# EAGLE board Open-Source_Control_Unitary_V2 (EAGLE 9.3.0), part 1 of 2
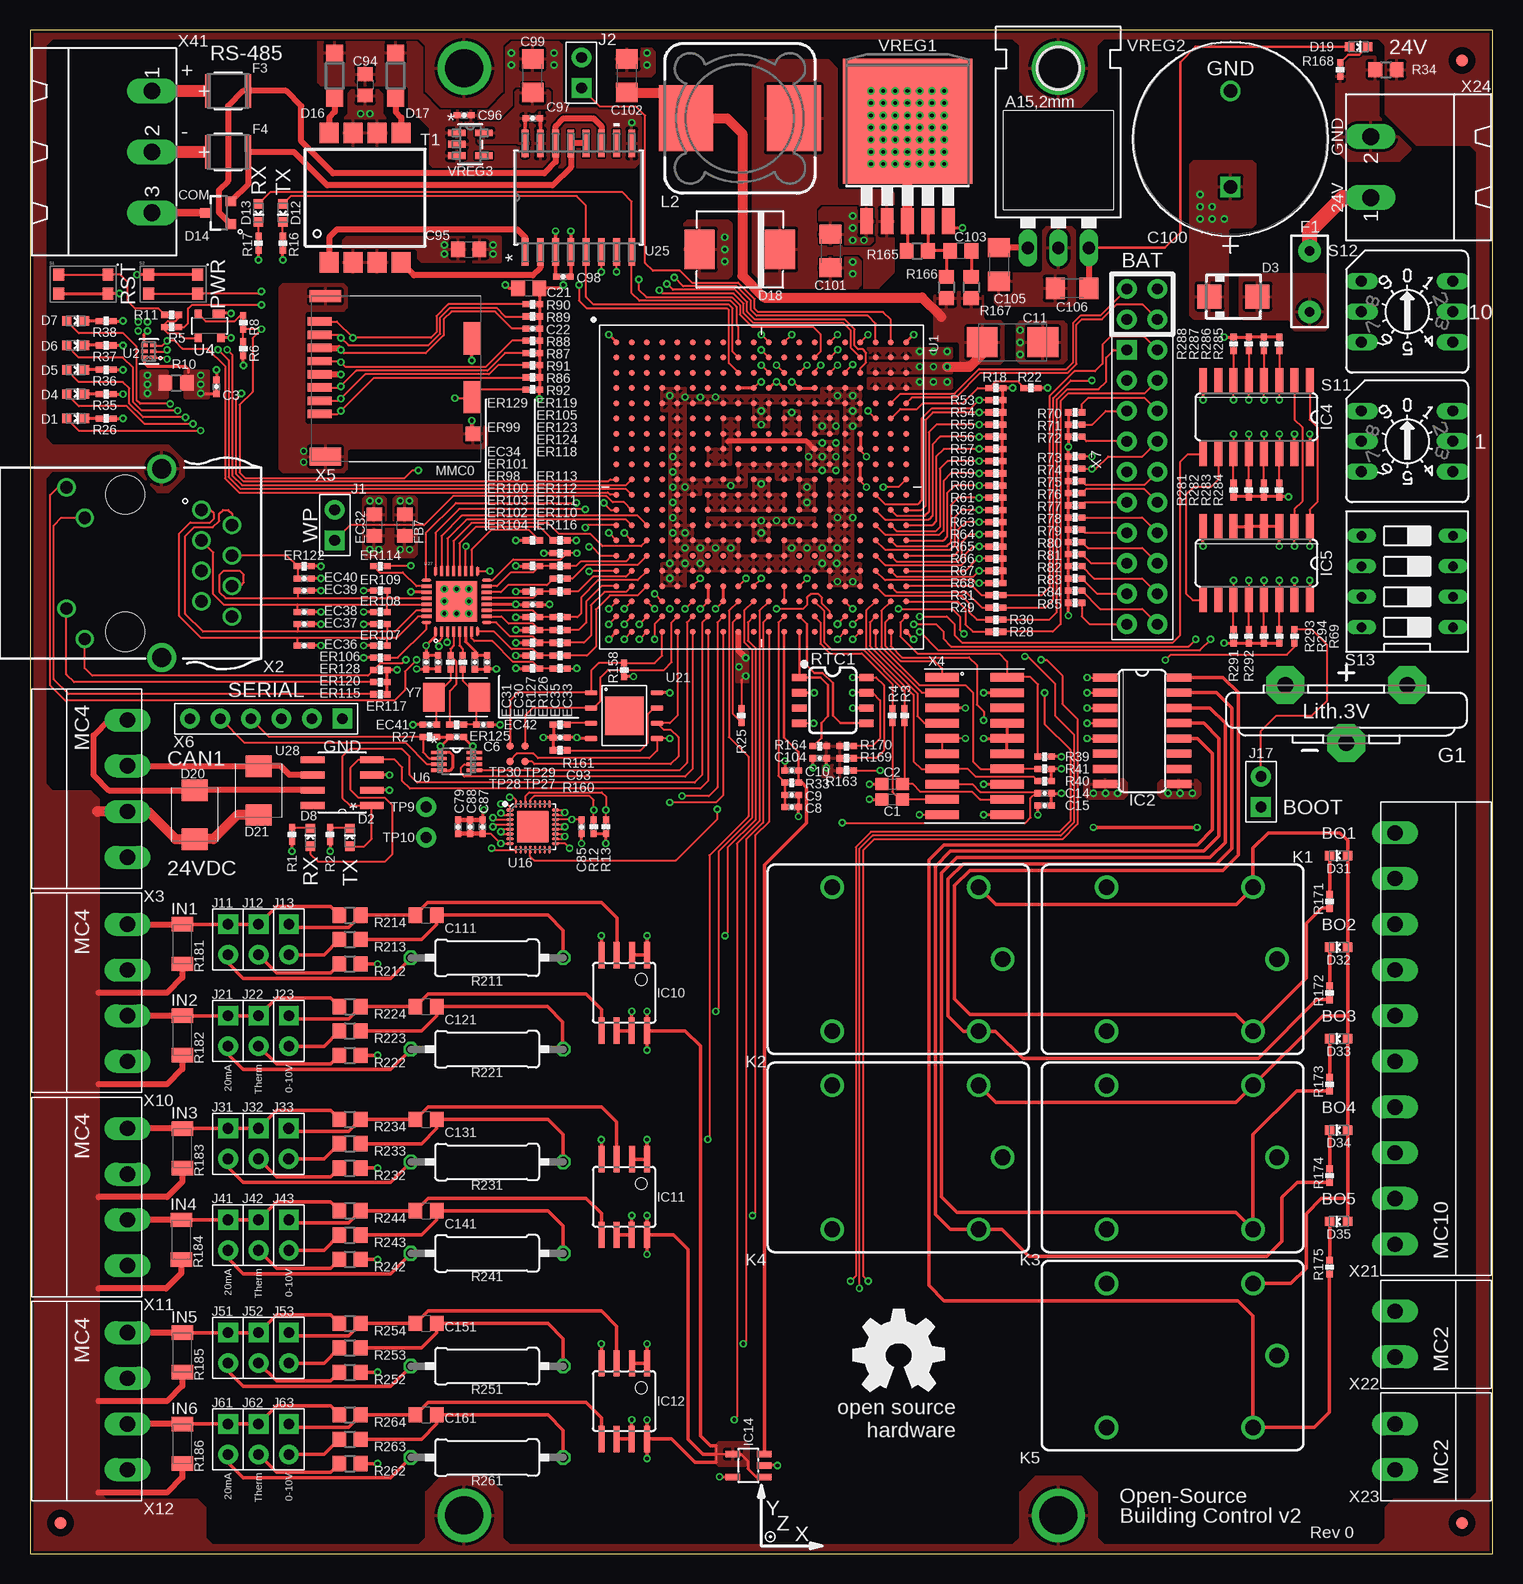
[diagram p7: board, top side]
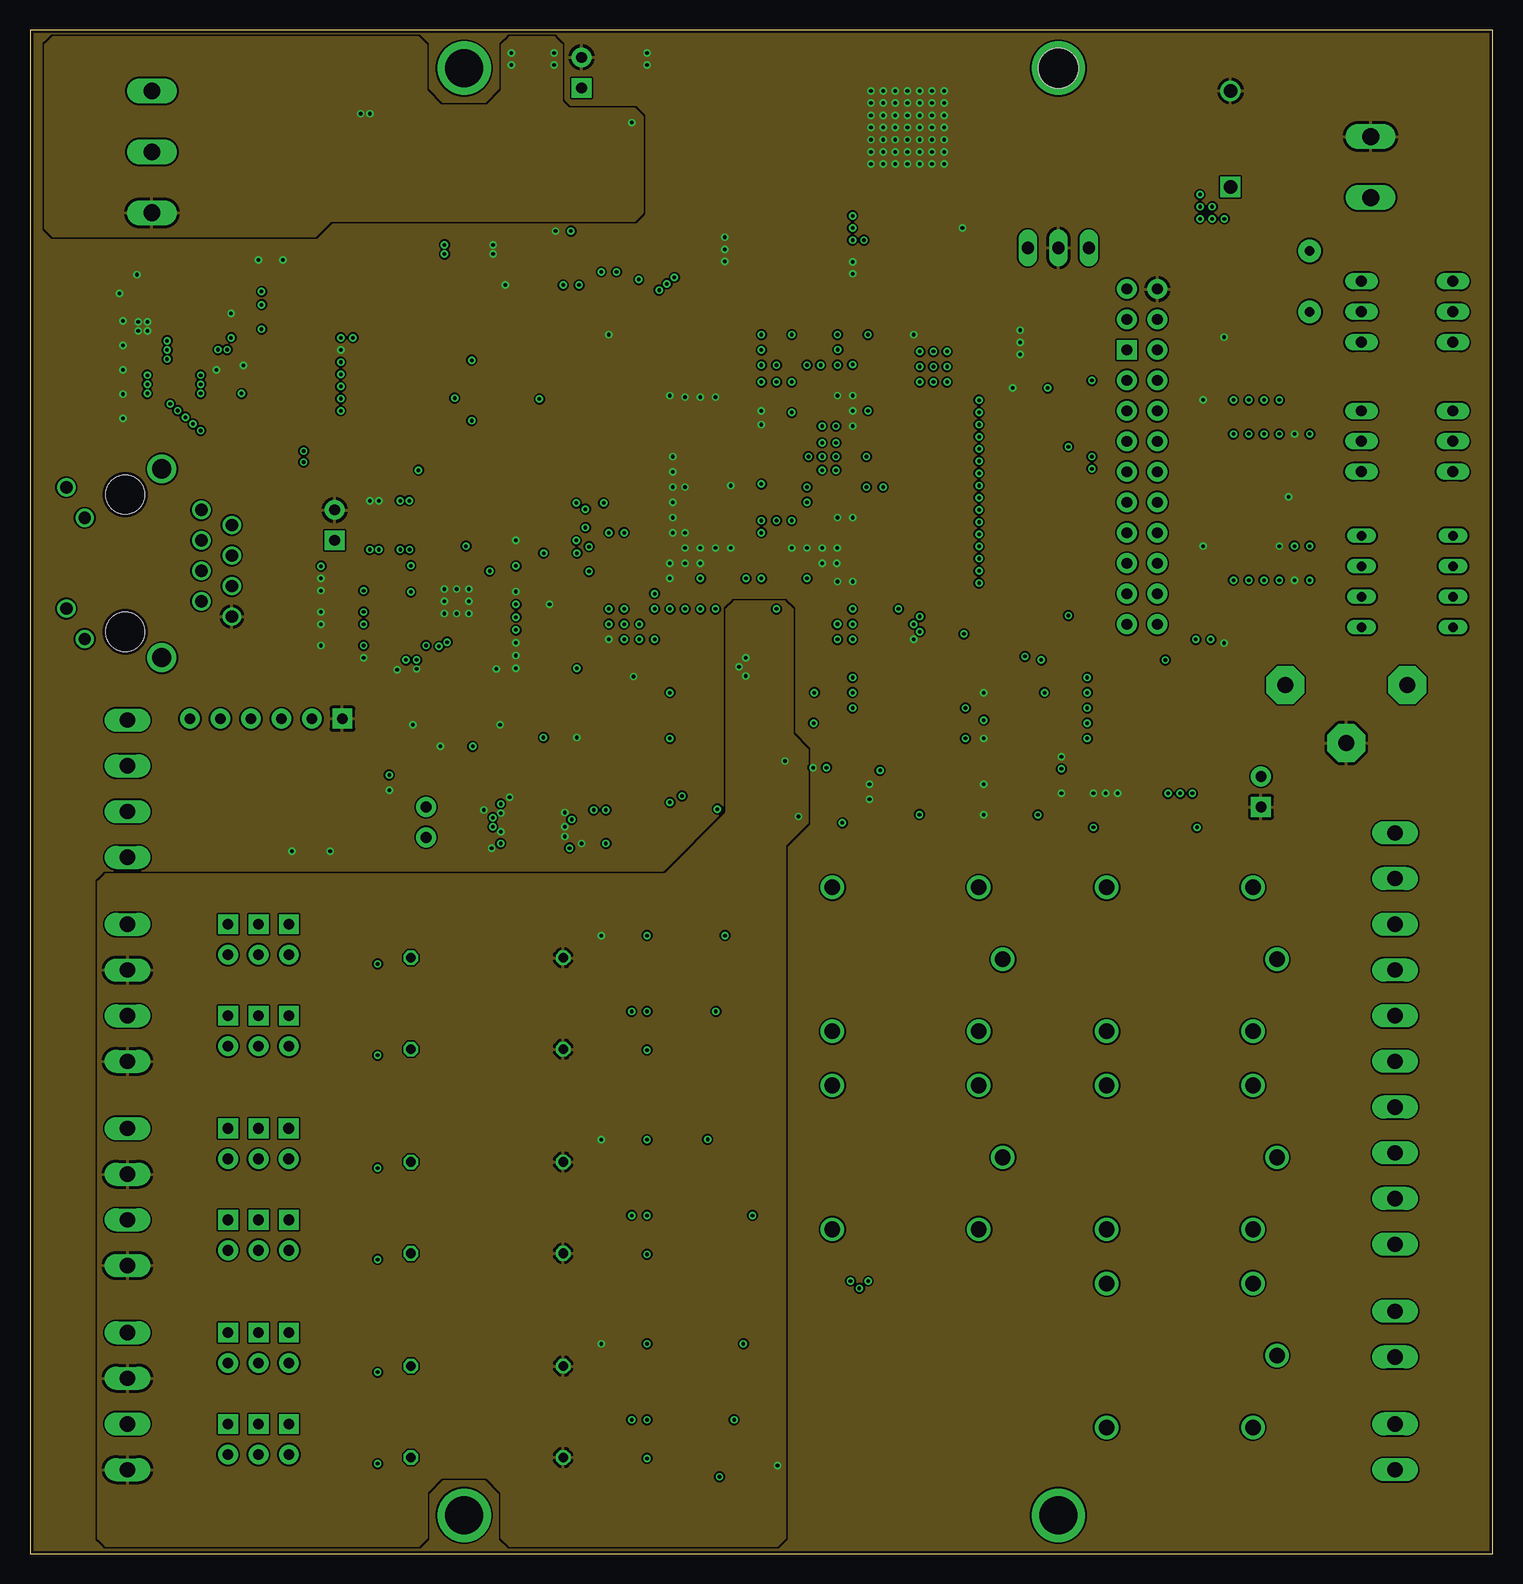
[diagram p8: board, inner layer Route2]
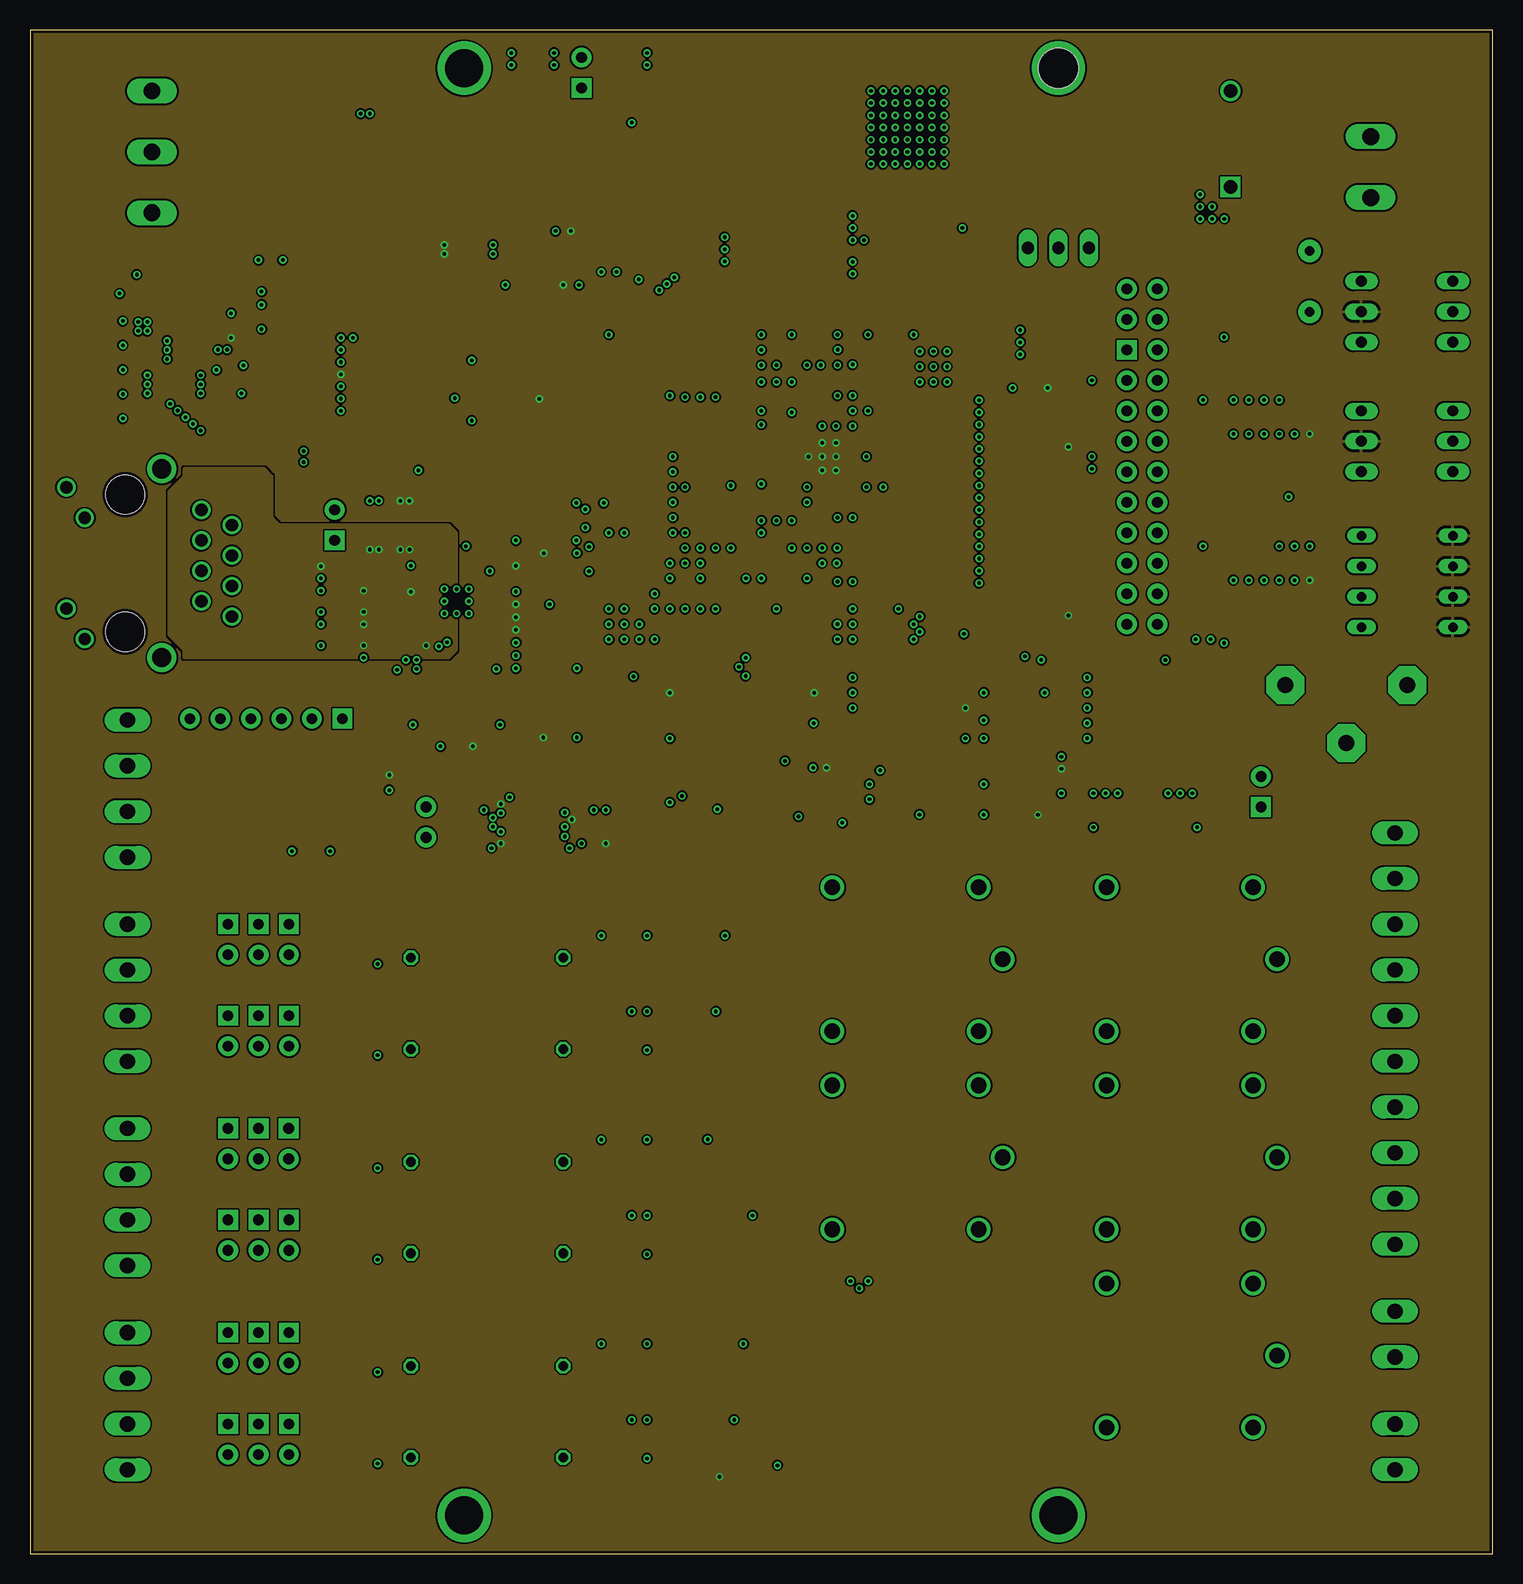
[diagram p9: board, inner layer Route15]
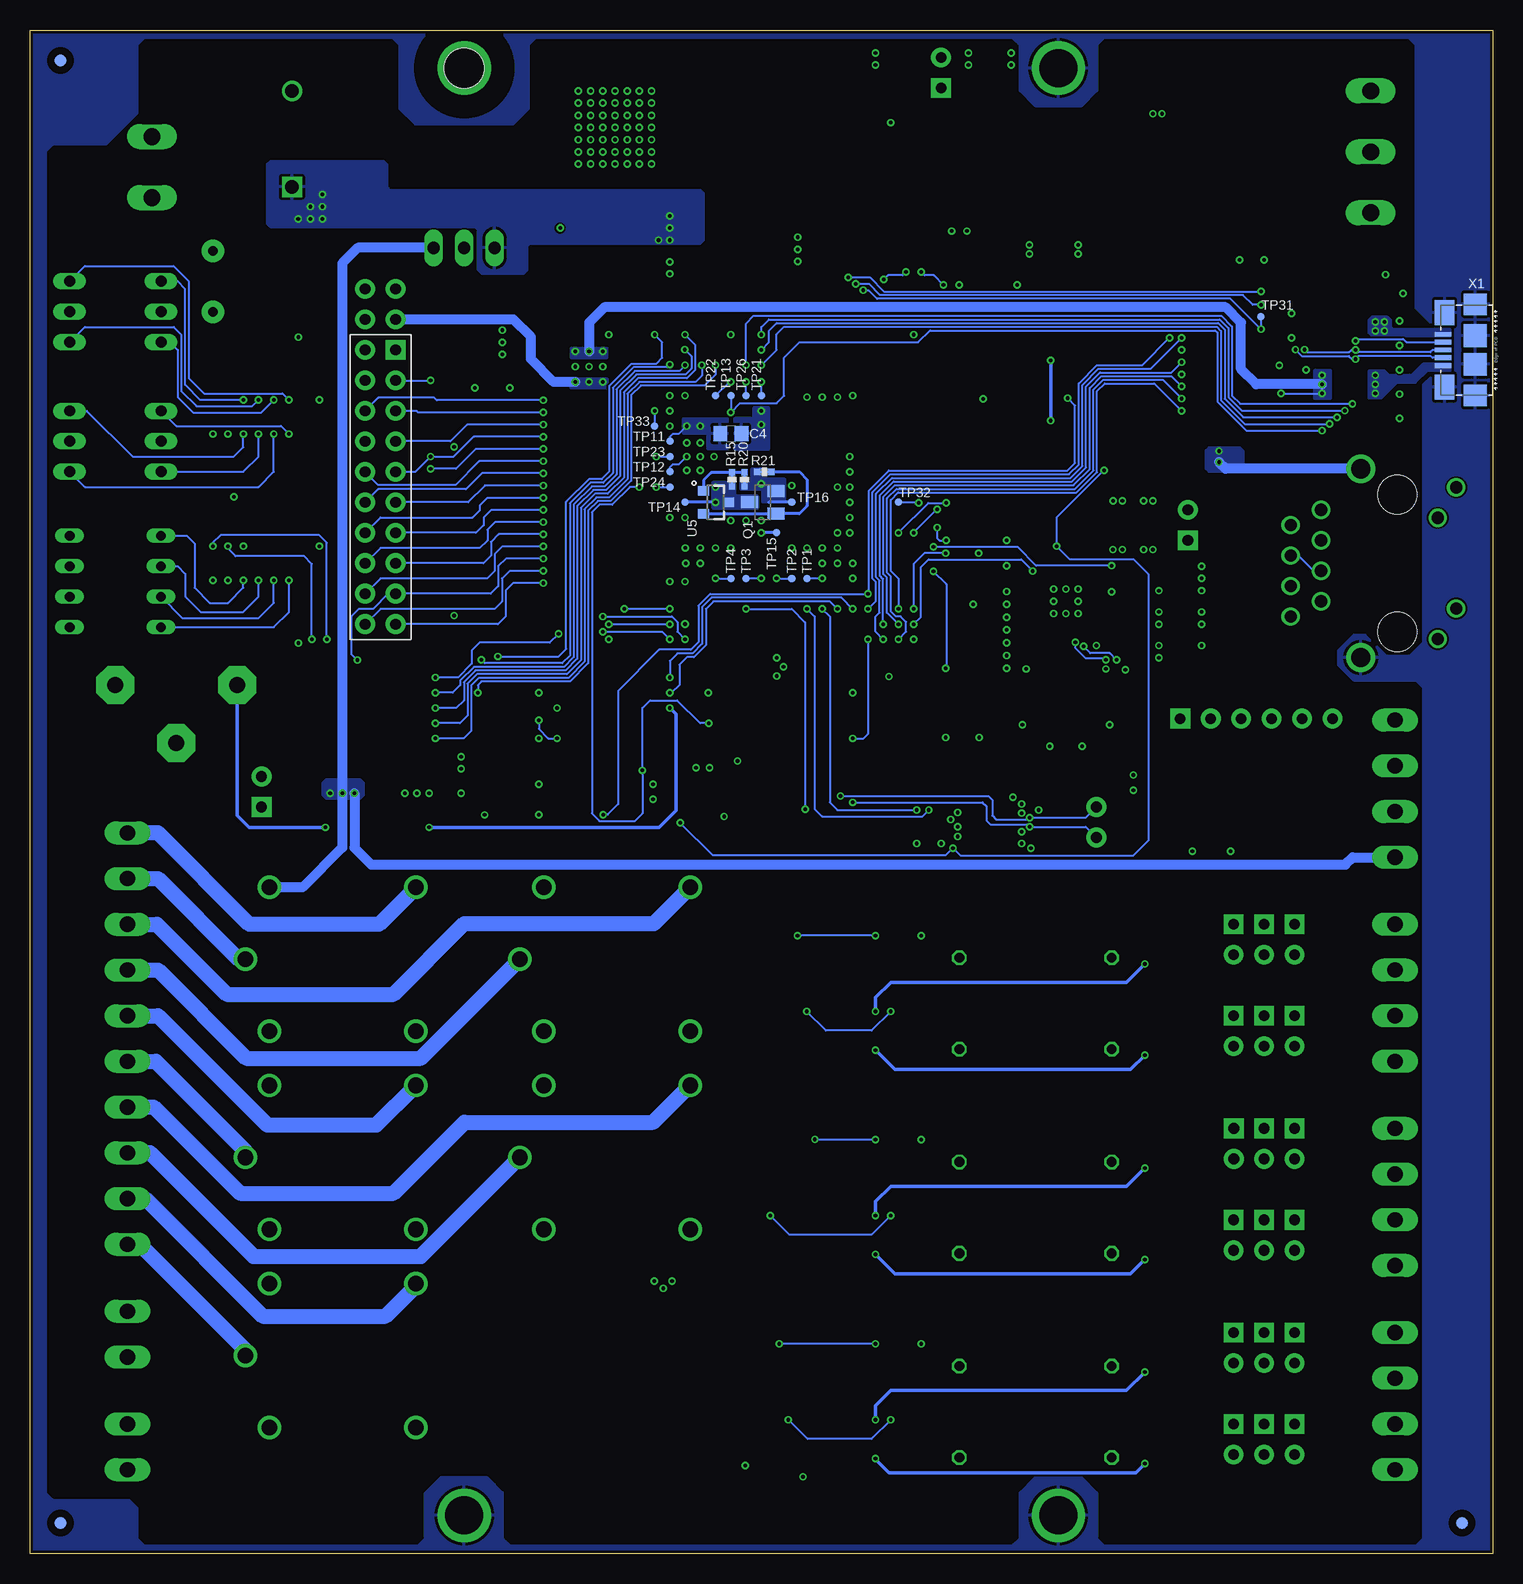
[diagram p10: board, bottom side, seen from below]

Size 121.92 x 127 mm. Coordinates in mm from the lower left corner, seen from the top.
Outline: 0,0 121.92,0 121.92,127 0,127 0,0
Copper layers (1*2*15*16): Top 0.035mm / dielectric 0.23mm / Route2 0.035mm / dielectric 0.93mm / Route15 0.035mm / dielectric 0.23mm / Bottom 0.035mm
Design rules "MF_Standard_4_Layer *": minimum track width 6mil, minimum drill 12mil, track to track 6mil, track to pad 6mil, pad to pad 6mil, via to via 6mil, smd to smd 0mil, copper to edge 10mil, drill to drill 10mil, minimum pad ring 6mil, minimum via ring 6mil, stop-mask expansion 2mil, vias tented up to drill 25mil, thermal gap 10mil
Net classes: 0 default: width 0.127 mm, drill 0.254 mm; 1 ground: width 0.152 mm, drill 0.254 mm, clearance 0.152 mm

## Footprints (pad centres in the part's own frame; a part is rotated, then mirrored left to right if it is on the bottom)
C0603 = smd 1.1 x 1: 1 -0.85,0; 2 0.85,0
C0402 = smd 0.61 x 0.508: 1 -0.559,0; 2 0.559,0
C0805 = smd 1.143 x 1.27: 1 -0.889,0; 2 0.889,0
C/6032-28R = smd 2.55 x 2.5: + 2.525,0; - -2.525,0
1206 = smd 1.6 x 1.8: 1 -1.4,0; 2 1.4,0
PCAP_16X25-THRU-ELECT = drill 1.118 pad 1.524 square: 1 -8.001,0 | drill 1.118 pad 1.524: 2 0,0
EIA-STD = smd 0.787 x 0.787: 1 -0.749,0; 2 0.749,0
SMA = smd 2 x 2: A 2,0; C -2,0
SOT23-3 = smd 0.8 x 0.9: 1 -0.95,-1; 2 0.95,-1; 3 0,1.1
SOD123 = smd 1.4 x 1.4: A 1.9,0; C -1.9,0
SMC = smd 2.5 x 3.3: A 3.35,0; C -3.35,0
SMBJ = smd 1.78 x 2.16: A 2.04,0; C -2.03,0
R0402 = smd 0.61 x 0.508: 1 -0.559,0; 2 0.559,0
PTH = drill 0.8 pad 1.88: P$1 -2.54,0; P$2 2.54,0
FUS_MICROSMD010F_TYCO = smd 0.457 x 2.794: 1 -1.689,0; 2 1.689,0
FIDUCIAL_40MIL = smd 1.016 x 1.016: P$1 0,0
CR2032V = drill 1.321 pad 3.15 octagon: + -2.54,-5.08; +@1 -2.54,5.08; - 2.286,0
SO16 = smd 0.66 x 2.032: 1 -4.445,-3.073; 2 -3.175,-3.073; 3 -1.905,-3.073; 4 -0.635,-3.073; 5 0.635,-3.073; 6 1.905,-3.073; 7 3.175,-3.073; 8 4.445,-3.073; 9 4.445,3.073; 10 3.175,3.073; 11 1.905,3.073; 12 0.635,3.073; 13 -0.635,3.073; 14 -1.905,3.073; 15 -3.175,3.073; 16 -4.445,3.073
SOIC8 = smd 0.5 x 2.2: 1 -1.905,-3.154; 2 -0.645,-3.154; 3 0.625,-3.154; 4 1.895,-3.154; 5 1.905,3.154; 6 0.635,3.154; 7 -0.635,3.154; 8 -1.905,3.154
SOT23-5 = smd 0.55 x 1.2: 1 -0.95,-1.3; 2 0,-1.3; 3 0.95,-1.3; 4 0.95,1.3; 5 -0.95,1.3
H2-2.54 = drill 0.889 pad 1.651 square: 1 0,1.27 | drill 0.889 pad 1.651: 2 0,-1.27
JS-M = drill 1.3: 1 6.7,6; 2 6.7,-6; C 8.7,0; NC -5.5,-6; NO -5.5,6
MSS1260 = smd 5.5 x 4.5: 1 0,4.5; 2 0,-4.5
MOUNTING_HOLE = drill 3.175 pad 4.445: P$1 0,0
SOT23-BEC = smd 1 x 1.4: B -0.95,-1.1; C 0,1.1; E 0.95,-1.1
R0805 = smd 1.143 x 1.27: 1 -0.889,0; 2 0.889,0
CT/CN1206 = smd 1.2 x 1.8: 1 -1.65,0; 2 1.65,0
0309/12 = drill 0.813 octagon: 1 -6.35,0; 2 6.35,0
SO08 = smd 0.6 x 1.2: 1 -1.905,-2.8; 2 -0.635,-2.8; 3 0.635,-2.8; 4 1.905,-2.8; 5 1.905,2.8; 6 0.635,2.8; 7 -0.635,2.8; 8 -1.905,2.8
SW4SMD_63X161LS = smd 0.9 x 1: 1 2.05,0.8; 2 2.05,-0.8; 3 -2.05,0.8; 4 -2.05,-0.8
P101 = drill 0.914 long: 1 3.81,-2.54; 2 -3.81,2.54; 4 3.81,2.54; 8 -3.81,-2.54; C 3.81,0; C1 -3.81,0
DS-04 = drill 0.813 long: 1 -3.81,-3.81; 2 -1.27,-3.81; 3 1.27,-3.81; 4 3.81,-3.81; 5 3.81,3.81; 6 1.27,3.81; 7 -1.27,3.81; 8 -3.81,3.81
DA230X-AL = smd 1.7 x 1.6: P$1 -5.4,3; P$2 -5.4,1; P$3 -5.4,-1; P$4 -5.4,-3; P$5 5.4,-3; P$6 5.4,-1; P$7 5.4,1; P$8 5.4,3
TP_B0,65 = smd 0.635 x 0.635: TP 0,0
TESTPAD/W_HOLE_1X1 = drill 0.889 pad 1.651: P$1 0,0
OSD335X-BGA-400 = smd 0.5 x 0.5: A1 -12.065,-12.065; A2 -12.065,-10.795; A3 -12.065,-9.525; A4 -12.065,-8.255; A5 -12.065,-6.985; A6 -12.065,-5.715; A7 -12.065,-4.445; A8 -12.065,-3.175; A9 -12.065,-1.905; A10 -12.065,-0.635; A11 -12.065,0.635; A12 -12.065,1.905; A13 -12.065,3.175; A14 -12.065,4.445; A15 -12.065,5.715; A16 -12.065,6.985; A17 -12.065,8.255; A18 -12.065,9.525; A19 -12.065,10.795; A20 -12.065,12.065; B1 -10.795,-12.065; B2 -10.795,-10.795; B3 -10.795,-9.525; B4 -10.795,-8.255; B5 -10.795,-6.985; B6 -10.795,-5.715; B7 -10.795,-4.445; B8 -10.795,-3.175; B9 -10.795,-1.905; B10 -10.795,-0.635; B11 -10.795,0.635; B12 -10.795,1.905; B13 -10.795,3.175; B14 -10.795,4.445; B15 -10.795,5.715; B16 -10.795,6.985; B17 -10.795,8.255; B18 -10.795,9.525; B19 -10.795,10.795; B20 -10.795,12.065; C1 -9.525,-12.065; C2 -9.525,-10.795; C3 -9.525,-9.525; C4 -9.525,-8.255; C5 -9.525,-6.985; C6 -9.525,-5.715; C7 -9.525,-4.445; C8 -9.525,-3.175; C9 -9.525,-1.905; C10 -9.525,-0.635; C11 -9.525,0.635; C12 -9.525,1.905; C13 -9.525,3.175; C14 -9.525,4.445; C15 -9.525,5.715; C16 -9.525,6.985; C17 -9.525,8.255; C18 -9.525,9.525; C19 -9.525,10.795; C20 -9.525,12.065; D1 -8.255,-12.065; D2 -8.255,-10.795; D3 -8.255,-9.525; D4 -8.255,-8.255; D5 -8.255,-6.985; D6 -8.255,-5.715; D7 -8.255,-4.445; D8 -8.255,-3.175; D9 -8.255,-1.905; D10 -8.255,-0.635; D11 -8.255,0.635; D12 -8.255,1.905; D13 -8.255,3.175; D14 -8.255,4.445; D15 -8.255,5.715; D16 -8.255,6.985; D17 -8.255,8.255; D18 -8.255,9.525; D19 -8.255,10.795; D20 -8.255,12.065; E1 -6.985,-12.065; E2 -6.985,-10.795; E3 -6.985,-9.525; E4 -6.985,-8.255; E5 -6.985,-6.985; E6 -6.985,-5.715; E7 -6.985,-4.445; E8 -6.985,-3.175; E9 -6.985,-1.905; E10 -6.985,-0.635; E11 -6.985,0.635; E12 -6.985,1.905; E13 -6.985,3.175; E14 -6.985,4.445; E15 -6.985,5.715; E16 -6.985,6.985; E17 -6.985,8.255; E18 -6.985,9.525; E19 -6.985,10.795; E20 -6.985,12.065; F1 -5.715,-12.065; F2 -5.715,-10.795; F3 -5.715,-9.525; F4 -5.715,-8.255; F5 -5.715,-6.985; F6 -5.715,-5.715; F7 -5.715,-4.445; F8 -5.715,-3.175; F9 -5.715,-1.905; F10 -5.715,-0.635; F11 -5.715,0.635; F12 -5.715,1.905; F13 -5.715,3.175; F14 -5.715,4.445; F15 -5.715,5.715; F16 -5.715,6.985; F17 -5.715,8.255; F18 -5.715,9.525; F19 -5.715,10.795; F20 -5.715,12.065; G1 -4.445,-12.065; G2 -4.445,-10.795; G3 -4.445,-9.525; G4 -4.445,-8.255; G5 -4.445,-6.985; G6 -4.445,-5.715; G7 -4.445,-4.445; G8 -4.445,-3.175; G9 -4.445,-1.905; G10 -4.445,-0.635; G11 -4.445,0.635; G12 -4.445,1.905; G13 -4.445,3.175; G14 -4.445,4.445; G15 -4.445,5.715; G16 -4.445,6.985; G17 -4.445,8.255; G18 -4.445,9.525; G19 -4.445,10.795; G20 -4.445,12.065; H1 -3.175,-12.065; H2 -3.175,-10.795; H3 -3.175,-9.525; H4 -3.175,-8.255; H5 -3.175,-6.985; H6 -3.175,-5.715; H7 -3.175,-4.445; H8 -3.175,-3.175; H9 -3.175,-1.905; H10 -3.175,-0.635; H11 -3.175,0.635; H12 -3.175,1.905; H13 -3.175,3.175; H14 -3.175,4.445; H15 -3.175,5.715; H16 -3.175,6.985; H17 -3.175,8.255; H18 -3.175,9.525; H19 -3.175,10.795; H20 -3.175,12.065; J1 -1.905,-12.065; J2 -1.905,-10.795; J3 -1.905,-9.525; J4 -1.905,-8.255; J5 -1.905,-6.985; J6 -1.905,-5.715; J7 -1.905,-4.445; J8 -1.905,-3.175; J9 -1.905,-1.905; J10 -1.905,-0.635; J11 -1.905,0.635; J12 -1.905,1.905; J13 -1.905,3.175; J14 -1.905,4.445; J15 -1.905,5.715; J16 -1.905,6.985; J17 -1.905,8.255; J18 -1.905,9.525; J19 -1.905,10.795; J20 -1.905,12.065; K1 -0.635,-12.065; K2 -0.635,-10.795; K3 -0.635,-9.525; K4 -0.635,-8.255; K5 -0.635,-6.985; K6 -0.635,-5.715; K7 -0.635,-4.445; K8 -0.635,-3.175; K9 -0.635,-1.905; K10 -0.635,-0.635; K11 -0.635,0.635; K12 -0.635,1.905; K13 -0.635,3.175; K14 -0.635,4.445; K15 -0.635,5.715; K16 -0.635,6.985; K17 -0.635,8.255; K18 -0.635,9.525; K19 -0.635,10.795; K20 -0.635,12.065; L1 0.635,-12.065; L2 0.635,-10.795; L3 0.635,-9.525; L4 0.635,-8.255; L5 0.635,-6.985; L6 0.635,-5.715; L7 0.635,-4.445; L8 0.635,-3.175; L9 0.635,-1.905; L10 0.635,-0.635; L11 0.635,0.635; L12 0.635,1.905; L13 0.635,3.175; L14 0.635,4.445; L15 0.635,5.715; L16 0.635,6.985; L17 0.635,8.255; L18 0.635,9.525; L19 0.635,10.795; L20 0.635,12.065; M1 1.905,-12.065; M2 1.905,-10.795; M3 1.905,-9.525; M4 1.905,-8.255; M5 1.905,-6.985; M6 1.905,-5.715; M7 1.905,-4.445; M8 1.905,-3.175; M9 1.905,-1.905; M10 1.905,-0.635; M11 1.905,0.635; M12 1.905,1.905; M13 1.905,3.175; M14 1.905,4.445; M15 1.905,5.715; M16 1.905,6.985; M17 1.905,8.255; M18 1.905,9.525; M19 1.905,10.795; M20 1.905,12.065; N1 3.175,-12.065; N2 3.175,-10.795; N3 3.175,-9.525; N4 3.175,-8.255; N5 3.175,-6.985; N6 3.175,-5.715; N7 3.175,-4.445; N8 3.175,-3.175; N9 3.175,-1.905; N10 3.175,-0.635; N11 3.175,0.635; N12 3.175,1.905; N13 3.175,3.175; N14 3.175,4.445; N15 3.175,5.715; N16 3.175,6.985; N17 3.175,8.255; N18 3.175,9.525; N19 3.175,10.795; N20 3.175,12.065; P1 4.445,-12.065; P2 4.445,-10.795; P3 4.445,-9.525; P4 4.445,-8.255; P5 4.445,-6.985; P6 4.445,-5.715; P7 4.445,-4.445; P8 4.445,-3.175; P9 4.445,-1.905; P10 4.445,-0.635; P11 4.445,0.635; P12 4.445,1.905; P13 4.445,3.175; P14 4.445,4.445; P15 4.445,5.715; P16 4.445,6.985; P17 4.445,8.255; P18 4.445,9.525; P19 4.445,10.795; P20 4.445,12.065; R1 5.715,-12.065; R2 5.715,-10.795; R3 5.715,-9.525; R4 5.715,-8.255; R5 5.715,-6.985; R6 5.715,-5.715; R7 5.715,-4.445; R8 5.715,-3.175; R9 5.715,-1.905; R10 5.715,-0.635; R11 5.715,0.635; R12 5.715,1.905; R13 5.715,3.175; R14 5.715,4.445; R15 5.715,5.715; R16 5.715,6.985; R17 5.715,8.255; R18 5.715,9.525; R19 5.715,10.795; R20 5.715,12.065; T1 6.985,-12.065; T2 6.985,-10.795; T3 6.985,-9.525; T4 6.985,-8.255; T5 6.985,-6.985; T6 6.985,-5.715; T7 6.985,-4.445; T8 6.985,-3.175; T9 6.985,-1.905; T10 6.985,-0.635; T11 6.985,0.635; T12 6.985,1.905; T13 6.985,3.175; T14 6.985,4.445; T15 6.985,5.715; T16 6.985,6.985; T17 6.985,8.255; T18 6.985,9.525; T19 6.985,10.795; T20 6.985,12.065; U1 8.255,-12.065; U2 8.255,-10.795; U3 8.255,-9.525; U4 8.255,-8.255; U5 8.255,-6.985; U6 8.255,-5.715; U7 8.255,-4.445; U8 8.255,-3.175; U9 8.255,-1.905; U10 8.255,-0.635; U11 8.255,0.635; U12 8.255,1.905; U13 8.255,3.175; U14 8.255,4.445; U15 8.255,5.715; U16 8.255,6.985; U17 8.255,8.255; U18 8.255,9.525; U19 8.255,10.795; U20 8.255,12.065; V1 9.525,-12.065; V2 9.525,-10.795; V3 9.525,-9.525; V4 9.525,-8.255; V5 9.525,-6.985; V6 9.525,-5.715; V7 9.525,-4.445; V8 9.525,-3.175; V9 9.525,-1.905; V10 9.525,-0.635; V11 9.525,0.635; V12 9.525,1.905; V13 9.525,3.175; V14 9.525,4.445; V15 9.525,5.715; V16 9.525,6.985; V17 9.525,8.255; V18 9.525,9.525; V19 9.525,10.795; V20 9.525,12.065; W1 10.795,-12.065; W2 10.795,-10.795; W3 10.795,-9.525; W4 10.795,-8.255; W5 10.795,-6.985; W6 10.795,-5.715; W7 10.795,-4.445; W8 10.795,-3.175; W9 10.795,-1.905; W10 10.795,-0.635; W11 10.795,0.635; W12 10.795,1.905; W13 10.795,3.175; W14 10.795,4.445; W15 10.795,5.715; W16 10.795,6.985; W17 10.795,8.255; W18 10.795,9.525; W19 10.795,10.795; W20 10.795,12.065; Y1 12.065,-12.065; Y2 12.065,-10.795; Y3 12.065,-9.525; Y4 12.065,-8.255; Y5 12.065,-6.985; Y6 12.065,-5.715; Y7 12.065,-4.445; Y8 12.065,-3.175; Y9 12.065,-1.905; Y10 12.065,-0.635; Y11 12.065,0.635; Y12 12.065,1.905; Y13 12.065,3.175; Y14 12.065,4.445; Y15 12.065,5.715; Y16 12.065,6.985; Y17 12.065,8.255; Y18 12.065,9.525; Y19 12.065,10.795; Y20 12.065,12.065
DRY6 = smd 0.55 x 0.3: 1 -0.355,0.5 | smd 0.52 x 0.3: 2 -0.37,0; 3 -0.37,-0.5; 4 0.37,-0.5; 5 0.37,0; 6 0.37,0.5
SOT143-R = smd 1 x 0.7: 1 -0.75,-1 | smd 0.6 x 0.7: 2 0.95,-1; 3 0.95,1; 4 -0.95,1
DCU8 = smd 1.27 x 0.254: 1 -1.473,0.749; 2 -1.473,0.249; 3 -1.473,-0.249; 4 -1.473,-0.749; 5 1.473,-0.749; 6 1.473,-0.249; 7 1.473,0.249; 8 1.473,0.749
QFN32-0.4-4X4MM = smd 0.6 x 0.2: 1 -1.9,1.4; 2 -1.9,1; 3 -1.9,0.6; 4 -1.9,0.2; 5 -1.9,-0.2; 6 -1.9,-0.6; 7 -1.9,-1; 8 -1.9,-1.4; 17 1.9,-1.4; 18 1.9,-1; 19 1.9,-0.6; 20 1.9,-0.2; 21 1.9,0.2; 22 1.9,0.6; 23 1.9,1; 24 1.9,1.4 | smd 0.2 x 0.6: 9 -1.4,-1.9; 10 -1,-1.9; 11 -0.6,-1.9; 12 -0.2,-1.9; 13 0.2,-1.9; 14 0.6,-1.9; 15 1,-1.9; 16 1.4,-1.9; 25 1.4,1.9; 26 1,1.9; 27 0.6,1.9; 28 0.2,1.9; 29 -0.2,1.9; 30 -0.6,1.9; 31 -1,1.9; 32 -1.4,1.9 | smd 2.7 x 2.7: 33 0,0
W-PDFN-8 = smd 1.05 x 0.45: 1 -2.75,1.905; 2 -2.75,0.635; 3 -2.75,-0.635; 4 -2.75,-1.905; 5 2.75,-1.905; 6 2.75,-0.635; 7 2.75,0.635; 8 2.75,1.905 | smd 3.2 x 3.2: PAD 0,0
DW16 = smd 2.311 x 0.559: 1 -4.521,4.445; 2 -4.521,3.175; 3 -4.521,1.905; 4 -4.521,0.635; 5 -4.521,-0.635; 6 -4.521,-1.905; 7 -4.521,-3.175; 8 -4.521,-4.445; 9 4.521,-4.445; 10 4.521,-3.175; 11 4.521,-1.905; 12 4.521,-0.635; 13 4.521,0.635; 14 4.521,1.905; 15 4.521,3.175; 16 4.521,4.445
LAN8710A-QFN32 = smd 0.254 x 0.838: 1 -1.751,-2.515; 2 -1.251,-2.515; 3 -0.751,-2.515; 4 -0.251,-2.515; 5 0.251,-2.515; 6 0.751,-2.515; 7 1.251,-2.515; 8 1.751,-2.515; 17 1.751,2.515; 18 1.251,2.515; 19 0.751,2.515; 20 0.251,2.515; 21 -0.251,2.515; 22 -0.751,2.515; 23 -1.251,2.515; 24 -1.751,2.515 | smd 0.838 x 0.254: 9 2.515,-1.751; 10 2.515,-1.251; 11 2.515,-0.751; 12 2.515,-0.251; 13 2.515,0.251; 14 2.515,0.751; 15 2.515,1.251; 16 2.515,1.751; 25 -2.515,1.751; 26 -2.515,1.251; 27 -2.515,0.751; 28 -2.515,0.251; 29 -2.515,-0.251; 30 -2.515,-0.751; 31 -2.515,-1.251; 32 -2.515,-1.751 | smd 3.404 x 3.404: 33 0,0
BEAGLEBONE_BLUE_D8 = smd 1.981 x 0.559: 1 -2.464,1.905; 2 -2.464,0.635; 3 -2.464,-0.635; 4 -2.464,-1.905; 5 2.464,-1.905; 6 2.464,-0.635; 7 2.464,0.635; 8 2.464,1.905
TO263-5 = smd 1.067 x 2.159: 1 -3.404,-5.791; 2 -1.702,-5.791; 3 0,-5.791; 4 1.702,-5.791; 5 3.404,-5.791 | smd 10.8 x 10.41: 6 0,2.54
78XXL = drill 1.016 long: GND 0,-3.81; IN -2.54,-3.81; OUT 2.54,-3.81 | hole 3.302: 0,11.176
DBV5 = smd 1.473 x 0.559: 1 -1.118,0.95; 2 -1.118,0; 3 -1.118,-0.95; 4 1.118,-0.95; 5 1.118,0.95
10118192-0001LF(MICRO-USB-B-AMPHENOL-FCI) = smd 1.8 x 1.9: CGND1 -3.8,0; CGND4 3.8,0 | smd 1.9 x 1.9: CGND2 -1.2,0; CGND3 1.2,0 | smd 2.1 x 1.6: CGND5 3.1,2.55; CGND6 -3.1,2.55 | smd 0.4 x 1.35: D+ 0,2.675; D- -0.65,2.675; GND 1.3,2.675; ID 0.65,2.675; VBUS -1.3,2.675
SI-50170 = drill 1.016 pad 1.524: 1 4.445,-6.413; 2 3.175,-8.954; 3 1.905,-6.413; 4 0.635,-8.954; 5 -0.635,-6.413; 6 -1.905,-8.954; 7 -3.175,-6.413; 8 -4.445,-8.954; A1 -6.325,3.315; A2 3.785,3.315; C1 -3.785,4.839; C2 6.325,4.839 | drill 1.6 pad 2.286: S1 -7.874,-3.111; S2 7.874,-3.111 | hole 3.251: -5.715,-0.064; 5.715,-0.064
MC4 = drill 1.27 long: 1 -5.715,0; 2 -1.905,0; 3 1.905,0; 4 5.715,0
CTI-JTAG = smd 2.794 x 0.711: 1 -2.705,5.715; 2 2.705,5.715; 3 -2.705,4.445; 4 2.705,4.445; 5 -2.705,3.175; 6 2.705,3.175; 7 -2.705,1.905; 8 2.705,1.905; 9 -2.705,0.635; 10 2.705,0.635; 11 -2.705,-0.635; 12 2.705,-0.635; 13 -2.705,-1.905; 14 2.705,-1.905; 15 -2.705,-3.175; 16 2.705,-3.175; 17 -2.705,-4.445; 18 2.705,-4.445; 19 -2.705,-5.715; 20 2.705,-5.715
DM3CS-SF = smd 0.7 x 2: 1 0,0; 2 -1.1,0; 3 -2.2,0; 4 -3.3,0; 5 -4.4,0; 6 -5.5,0; 7 -6.6,0; 8 -7.7,0 | smd 1 x 2.6: 9 -9.8,0.5 | smd 1.5 x 2.6: 10 3.55,0.5 | smd 1.2 x 1.2: 11 1.65,12.8 | smd 2.7 x 1.4: 12 -1.4,12.7; 13 -6.3,12.7
H6-2.54 = drill 0.889 pad 1.651 square: 1 0,6.35 | drill 0.889 pad 1.651: 2 0,3.81; 3 0,1.27; 4 0,-1.27; 5 0,-3.81; 6 0,-6.35
H2X10-2.54 = drill 0.889 pad 1.651 square: 1 -1.27,11.43 | drill 0.889 pad 1.651: 2 1.27,11.43; 3 -1.27,8.89; 4 1.27,8.89; 5 -1.27,6.35; 6 1.27,6.35; 7 -1.27,3.81; 8 1.27,3.81; 9 -1.27,1.27; 10 1.27,1.27; 11 -1.27,-1.27; 12 1.27,-1.27; 13 -1.27,-3.81; 14 1.27,-3.81; 15 -1.27,-6.35; 16 1.27,-6.35; 17 -1.27,-8.89; 18 1.27,-8.89; 19 -1.27,-11.43; 20 1.27,-11.43
MC10 = drill 1.27 long: 1 -17.145,0; 2 -13.335,0; 3 -9.525,0; 4 -5.715,0; 5 -1.905,0; 6 1.905,0; 7 5.715,0; 8 9.525,0; 9 13.335,0; 10 17.145,0
MC2 = drill 1.27 long: 1 -1.905,0; 2 1.905,0
MSTBA2 = drill 1.397 long: 1 -2.54,5.08; 2 2.54,5.08
MSTBA3 = drill 1.397 long: 1 -5.08,5.08; 2 0,5.08; 3 5.08,5.08
CRYSTAL-TXC-7A = smd 1.788 x 2.413: P$1 1.9,0; P$2 -1.9,0

## Placement (x,y rotation side)
C1  DNI  [C0603]  71.88,62.87 0 top
C2  DNI  [C0603]  71.88,64.14 0 top
C3  0.1uF, 6.3V  [C0402]  15.54,97.26 90 top
C4  47uF  [C0805]  63.5,93.34 0 bottom
C6  0.1uF, 6.3V  [C0402]  35.56,68.07 0 top
C8  1nF  [C0402]  63.5,62.23 0 top
C9  0.1uF, 6.3V  [C0402]  63.5,63.25 0 top
C10  0.1uF, 6.3V  [C0402]  63.5,65.28 180 top
C11  220uF, 6.3V T491C227K006AT  [C/6032-28R]  81.92,100.97 180 top
C14  0.1uF, 6.3V  [C0402]  84.58,63.37 0 top
C15  0.1uF, 6.3V  [C0402]  84.58,62.36 0 top
C21  10uF, 10V  [C0805]  41.58,105.46 180 top
C22  0.1uF, 6.3V  [C0402]  41.91,102.11 180 top
C79  0.1uF, 6.3V  [C0402]  35.69,60.58 90 top
C85  2200pF, 6.3V  [C0402]  45.97,60.58 270 top
C87  2200pF, 6.3V  [C0402]  37.72,60.58 90 top
C88  2200pF, 6.3V  [C0402]  36.7,60.58 90 top
C93  0.1uF, 6.3V  [C0402]  44.2,68.02 0 top
C94  10uF, 16V  [C0805]  27.94,122.43 270 top
C95  10uF, 16V  [C0805]  36.58,108.71 0 top
C96  0.1uF, 16V  [C0402]  36.2,119.89 0 top
C97  0.1uF, 16V  [C0402]  41.91,119.63 0 top
C98  0.1uF, 16V  [C0402]  44.45,106.43 180 top
C99  4.7uF  [1206]  41.91,123.19 90 top
C100  1000uF, 50V, UHE1H102MHD6  [PCAP_16X25-THRU-ELECT]  100.08,121.92 90 top
C101  4.7uF, 50V  [1206]  66.73,108.58 270 top
C102  4.7uF  [1206]  49.76,123.19 90 top
C103  330pF, DNI  [C0805]  77.6,108.58 180 top
C104  0.1uF, 6.3V  [C0402]  65.84,66.29 180 top
C105  0.33uF, 50V  [1206]  80.77,107.44 270 top
C106  0.1uF, 50V  [1206]  86.87,105.46 180 top
C111  1uF  [C0805]  33.02,53.21 0 top
C121  1uF  [C0805]  33.02,45.59 0 top
C131  1uF  [C0805]  33.02,36.2 0 top
C141  1uF  [C0805]  33.02,28.57 0 top
C151  1uF  [C0805]  33.02,19.18 0 top
C161  1uF  [C0805]  33.02,11.56 0 top
D1  LTST-C191KFKT  [EIA-STD]  3.81,94.61 0 top
D2  LTST-C191KFKT  [EIA-STD]  26.67,59.69 90 top
D3  S1D  [SMA]  100.33,104.78 0 top
D4  LTST-C191KGKT  [EIA-STD]  3.81,96.65 0 top
D5  LTST-C191KGKT  [EIA-STD]  3.81,98.68 0 top
D6  LTST-C191KGKT  [EIA-STD]  3.81,100.71 0 top
D7  LTST-C191KGKT  [EIA-STD]  3.81,102.74 0 top
D8  LTST-C191KGKT  [EIA-STD]  23.37,59.69 90 top
D12  LTST-C191KFKT  [EIA-STD]  21.08,111.76 270 top
D13  LTST-C191KGKT  [EIA-STD]  19.05,111.76 270 top
D14  SM712  [SOT23-3]  15.75,111.76 90 top
D16  MBR0520LT  [SOD123]  25.4,123.19 270 top
D17  MBR0520LT  [SOD123]  30.48,123.19 270 top
D18  B550C-13-F  [SMC]  59.18,108.71 180 top
D19  LTST-C191KRKT  [EIA-STD]  110.74,125.6 0 top
D20  SMBJ7.0CA  [SMBJ]  13.72,61.59 270 top
D21  SMBJ7.0CA  [SMBJ]  19.05,63.6 270 top
D31  LTST-C191KRKT  [EIA-STD]  109.09,58.17 180 top
D32  LTST-C191KRKT  [EIA-STD]  109.09,50.55 180 top
D33  LTST-C191KRKT  [EIA-STD]  109.09,42.93 180 top
D34  LTST-C191KRKT  [EIA-STD]  109.09,35.31 180 top
D35  LTST-C191KRKT  [EIA-STD]  109.09,27.69 180 top
EC30  0.1uF, 6.3V  [C0402]  34.04,74.3 270 top
EC31  0.1uF, 6.3V  [C0402]  33.02,74.3 270 top
EC32  10uF, 10V  [C0805]  28.7,85.72 90 top
EC33  1uF, 10V  [C0402]  38.1,74.3 270 top
EC34  0.1uF, 6.3V  [C0402]  41.91,79.12 0 top
EC35  470pF, 6.3V  [C0402]  37.08,74.3 270 top
EC36  15pF, DNI  [C0402]  22.86,75.69 0 top
EC37  15pF, DNI  [C0402]  22.86,77.47 0 top
EC38  15pF, DNI  [C0402]  22.86,78.49 0 top
EC39  15pF, DNI  [C0402]  22.86,80.26 0 top
EC40  0.022uF, 10V  [C0402]  22.86,81.28 0 top
EC41  30pF, 50V  [C0402]  33.32,69.09 180 top
EC42  30pF, 50V  [C0402]  37.8,69.09 0 top
ER98  1.5K, 1%  [R0402]  41.91,78.05 0 top
ER99  1.5K, 1%  [R0402]  41.91,82.32 0 top
ER100  1.5K, 1%  [R0402]  41.91,76.99 0 top
ER101  10K, 1%  [R0402]  41.91,80.19 180 top
ER102  10K, 1%  [R0402]  41.91,74.85 180 top
ER103  10K, 1%  [R0402]  41.91,75.92 180 top
ER104  10K, 1%  [R0402]  41.91,73.79 180 top
ER105  1.5K, 1%  [R0402]  44.2,83.39 0 top
ER106  49.9, 1%  [R0402]  29.21,75.69 0 top
ER107  49.9, 1%  [R0402]  29.21,77.47 0 top
ER108  49.9, 1%  [R0402]  29.21,78.49 0 top
ER109  49.9, 1%  [R0402]  29.21,80.26 0 top
ER110  100, 1%  [R0402]  44.2,74.85 0 top
ER111  100, 1%  [R0402]  44.2,75.92 0 top
ER112  100, 1%  [R0402]  44.2,76.99 0 top
ER113  100, 1%  [R0402]  44.2,78.05 0 top
ER114  100, 1%  [R0402]  29.21,82.3 0 top
ER115  470, 1%  [R0402]  29.21,72.64 180 top
ER116  100, 1%  [R0402]  44.2,73.79 0 top
ER117  470, 1%  [R0402]  29.21,71.63 180 top
ER118  100, 1%  [R0402]  44.2,80.19 0 top
ER119  100, 1%  [R0402]  44.2,84.45 0 top
ER120  10K, 1%  [R0402]  29.21,73.66 180 top
ER122  0, 1%  [R0402]  22.86,82.3 180 top
ER123  100, 1%  [R0402]  44.2,82.32 0 top
ER124  100, 1%  [R0402]  44.2,81.25 0 top
ER125  1M, 1%, DNI  [R0402]  35.56,69.09 0 top
ER126  0, 1%  [R0402]  36.07,74.3 270 top
ER127  10, 1%  [R0402]  35.05,74.3 270 top
ER128  12.1K, 1%  [R0402]  29.21,74.68 0 top
ER129  10K, 1%  [R0402]  41.91,84.45 180 top
F1  60V, 750mA, R075  [PTH]  106.68,106.05 270 top
F3  MICROSMD010F-2  [FUS_MICROSMD010F_TYCO]  16.51,121.92 0 top
F4  MICROSMD010F-2  [FUS_MICROSMD010F_TYCO]  16.51,116.84 0 top
FB7  150ohm, 800mA  [C0805]  31.24,85.72 270 top
FUD1  FIDUCIAL  [FIDUCIAL_40MIL]  119.38,2.54 0 top
FUD2  FIDUCIAL  [FIDUCIAL_40MIL]  119.38,124.46 0 top
FUD3  FIDUCIAL  [FIDUCIAL_40MIL]  2.54,2.54 0 top
FUD4  FIDUCIAL  [FIDUCIAL_40MIL]  119.38,124.46 90 bottom
FUD5  FIDUCIAL  [FIDUCIAL_40MIL]  2.54,2.54 90 bottom
FUD6  FIDUCIAL  [FIDUCIAL_40MIL]  119.38,2.54 90 bottom
G1  CR2032V  [CR2032V]  109.73,69.85 270 top
IC2  ULN2003AD  [SO16]  92.71,68.58 270 top
IC4  74HC165D  [SO16]  102.23,94.74 180 top
IC5  74HC165D  [SO16]  102.23,82.55 180 top
IC10  MCP6002SMT  [SOIC8]  49.53,46.74 180 top
IC11  MCP6002SMT  [SOIC8]  49.53,29.72 180 top
IC12  MCP6002SMT  [SOIC8]  49.53,12.7 180 top
IC14  MCP6001  [SOT23-5]  59.89,7.34 90 top
J1  [H2-2.54]  25.4,85.72 180 top
J2  [H2-2.54]  45.97,123.44 180 top
J11  [H2-2.54]  16.51,51.18 0 top
J12  [H2-2.54]  19.05,51.18 0 top
J13  [H2-2.54]  21.59,51.18 0 top
J17  [H2-2.54]  102.62,63.5 180 top
J21  [H2-2.54]  16.51,43.56 0 top
J22  [H2-2.54]  19.05,43.56 0 top
J23  [H2-2.54]  21.59,43.56 0 top
J31  [H2-2.54]  16.51,34.16 0 top
J32  [H2-2.54]  19.05,34.16 0 top
J33  [H2-2.54]  21.56,34.16 0 top
J41  [H2-2.54]  16.51,26.54 0 top
J42  [H2-2.54]  19.05,26.54 0 top
J43  [H2-2.54]  21.59,26.54 0 top
J51  [H2-2.54]  16.51,17.14 0 top
J52  [H2-2.54]  19.05,17.14 0 top
J53  [H2-2.54]  21.59,17.14 0 top
J61  [H2-2.54]  16.51,9.53 0 top
J62  [H2-2.54]  19.05,9.53 0 top
J63  [H2-2.54]  21.59,9.53 0 top
K1  JS1-24V-F  [JS-M]  95.25,49.53 0 top
K2  JS1-24V-F  [JS-M]  72.39,49.53 0 top
K3  JS1-24V-F  [JS-M]  95.25,33.02 0 top
K4  JS1-24V-F  [JS-M]  72.39,33.02 0 top
K5  JS1-24V-F  [JS-M]  95.25,16.51 0 top
L2  MSS1260-474KLD  [MSS1260]  59.18,119.63 270 top
MGT1  MOUNTING_HOLE  [MOUNTING_HOLE]  36.2,3.17 0 top
MGT2  MOUNTING_HOLE  [MOUNTING_HOLE]  85.72,3.17 0 top
MGT3  MOUNTING_HOLE  [MOUNTING_HOLE]  36.2,123.83 0 top
MGT4  MOUNTING_HOLE  [MOUNTING_HOLE]  85.72,123.83 0 top
Q1  MMBT2907  [SOT23-BEC]  60.83,87.63 90 bottom
R1  1.5K, 1%  [R0402]  21.84,59.94 270 top
R2  1.5K, 1%  [R0402]  25.02,59.94 270 top
R3  0, 1%  [R0402]  72.9,69.85 270 top
R4  0, 1%  [R0402]  71.88,69.85 270 top
R5  0  [R0402]  11.81,102.23 180 top
R6  100K, DNI  [R0402]  17.78,100.43 90 top
R8  1K  [R0402]  17.78,102.62 90 top
R10  0, 1%  [R0805]  12.19,97.59 0 top
R11  0  [R0402]  11.81,103.25 0 top
R12  1.5K, 1%  [R0402]  46.99,60.58 270 top
R13  1.5K, 1%  [R0402]  48.01,60.58 270 top
R15  40.2K  [R0402]  63.4,89.53 90 bottom
R16  1.5K, 1%  [R0402]  21.08,109.22 270 top
R17  1.5K, 1%  [R0402]  19.05,109.22 270 top
R18  4.75K, 1%  [R0402]  80.52,97.16 180 top
R20  10K  [R0402]  62.36,89.53 270 bottom
R21  499  [R0402]  60.71,90.17 180 bottom
R22  4.75K, 1%  [R0402]  83.44,97.16 0 top
R25  0, 1%  [R0402]  59.31,69.85 90 top
R26  1.5K, 1%  [R0402]  6.35,94.61 0 top
R27  100K, 1%  [R0402]  33.32,68.07 180 top
R28  0, 1%  [R0402]  80.52,76.83 0 top
R29  0, 1%  [R0402]  80.52,78.87 0 top
R30  0, 1%  [R0402]  80.52,77.85 0 top
R31  22, 1%  [R0402]  80.52,79.88 0 top
R33  0, 1%  [R0402]  63.5,64.26 0 top
R34  .1, 0805  [R0805]  113.03,123.7 0 top
R35  1.5K, 1%  [R0402]  6.35,96.65 0 top
R36  1.5K, 1%  [R0402]  6.35,98.68 0 top
R37  1.5K, 1%  [R0402]  6.35,100.71 0 top
R38  1.5K, 1%  [R0402]  6.35,102.74 0 top
R39  4.75K, 1%  [R0402]  84.58,66.42 180 top
R40  4.75K, 1%  [R0402]  84.58,64.39 0 top
R41  4.75K, 1%  [R0402]  84.58,65.41 0 top
R53  100K, 1%  [R0402]  80.52,96.14 180 top
R54  100K, 1%, DNI  [R0402]  80.52,95.12 180 top
R55  100K, 1%  [R0402]  80.52,94.11 180 top
R56  100K, 1%  [R0402]  80.52,93.09 180 top
R57  100K, 1%  [R0402]  80.52,92.08 180 top
R58  100K, 1%  [R0402]  80.52,91.06 180 top
R59  100K, 1%  [R0402]  80.52,90.04 180 top
R60  100K, 1%  [R0402]  80.52,89.03 180 top
R61  100K, 1%  [R0402]  80.52,88.01 180 top
R62  100K, 1%  [R0402]  80.52,87 180 top
R63  100K, 1%  [R0402]  80.52,85.98 180 top
R64  100K, 1%, DNI  [R0402]  80.52,84.96 180 top
R65  100K, 1%, DNI  [R0402]  80.52,83.95 180 top
R66  100K, 1%, DNI  [R0402]  80.52,82.93 180 top
R67  100K, 1%  [R0402]  80.52,81.92 180 top
R68  100K, 1%  [R0402]  80.52,80.9 180 top
R69  100, 1%  [R0402]  105.41,76.45 90 top
R70  100K, 1%, DNI  [R0402]  87.12,95.12 180 top
R71  100K, 1%  [R0402]  87.12,94.11 180 top
R72  100K, 1%, DNI  [R0402]  87.12,93.09 180 top
R73  100K, 1%, DNI  [R0402]  87.12,91.44 180 top
R74  100K, 1%, DNI  [R0402]  87.12,90.42 180 top
R75  100K, 1%, DNI  [R0402]  87.12,89.41 180 top
R76  100K, 1%, DNI  [R0402]  87.12,88.39 180 top
R77  100K, 1%, DNI  [R0402]  87.12,87.38 180 top
R78  100K, 1%, DNI  [R0402]  87.12,86.36 180 top
R79  100K, 1%, DNI  [R0402]  87.12,85.34 180 top
R80  100K, 1%, DNI  [R0402]  87.12,84.33 180 top
R81  100K, 1%  [R0402]  87.12,83.31 180 top
R82  100K, 1%  [R0402]  87.12,82.3 180 top
R83  100K, 1%  [R0402]  87.12,81.28 180 top
R84  100K, 1%, DNI  [R0402]  87.12,80.26 180 top
R85  100K, 1%, DNI  [R0402]  87.12,79.25 180 top
R86  10K, 1%  [R0402]  41.91,98.04 0 top
R87  10K, 1%  [R0402]  41.91,100.08 0 top
R88  10K, 1%  [R0402]  41.91,101.09 0 top
R89  10K, 1%  [R0402]  41.91,103.12 0 top
R90  10K, 1%  [R0402]  41.91,104.14 0 top
R91  10K, 1%  [R0402]  41.91,99.06 0 top
R92  10K, 1%  [R0402]  41.91,97.03 0 top
R158  100K, 1%  [R0402]  49.53,73.66 270 top
R160  10K, 1%  [R0402]  44.2,66.95 0 top
R161  10K, 1%  [R0402]  44.2,69.09 0 top
R163  100K, 1% DNI  [R0402]  68.07,65.28 180 top
R164  1.5K, 1%  [R0402]  65.84,67.31 180 top
R165  1.00K, 1%  [R0805]  73.96,108.58 0 top
R166  3.09K, 1%  [R0805]  76.4,105.54 270 top
R167  100, 5% DNI  [R0805]  78.46,105.54 270 top
R168  10K, 1%  [R0402]  109.22,123.7 270 top
R169  1.5K, 1%  [R0402]  68.07,66.29 180 top
R170  1.5K, 1%  [R0402]  68.07,67.31 180 top
R171  10K, 1%  [R0402]  108.33,54.36 270 top
R172  10K, 1%  [R0402]  108.33,46.74 270 top
R173  10K, 1%  [R0402]  108.33,39.12 270 top
R174  10K, 1%  [R0402]  108.33,31.5 270 top
R175  10K, 1%  [R0402]  108.33,23.88 270 top
R181  B72520T0300K062  [CT/CN1206]  12.7,50.8 270 top
R182  B72520T0300K062  [CT/CN1206]  12.7,43.18 270 top
R183  B72520T0300K062  [CT/CN1206]  12.7,33.78 270 top
R184  B72520T0300K062  [CT/CN1206]  12.62,26.16 270 top
R185  B72520T0300K062  [CT/CN1206]  12.7,16.76 270 top
R186  B72520T0300K062  [CT/CN1206]  12.7,9.14 270 top
R211  80, 0.1%  [0309/12]  38.1,49.66 180 top
R212  10K, 1%  [R0805]  26.67,49.15 0 top
R213  2K, 1%  [R0805]  26.67,51.18 0 top
R214  10K, 1%  [R0805]  26.67,53.21 0 top
R221  80, 0.1%  [0309/12]  38.1,42.04 180 top
R222  10K, 1%  [R0805]  26.67,41.53 0 top
R223  2K, 1%  [R0805]  26.67,43.56 0 top
R224  10K, 1%  [R0805]  26.67,45.59 0 top
R231  80, 0.1%  [0309/12]  38.1,32.64 180 top
R232  10K, 1%  [R0805]  26.67,32.13 0 top
R233  2K, 1%  [R0805]  26.67,34.16 0 top
R234  10K, 1%  [R0805]  26.67,36.2 0 top
R241  80, 0.1%  [0309/12]  38.1,25.02 180 top
R242  10K, 1%  [R0805]  26.67,24.51 0 top
R243  2K, 1%  [R0805]  26.67,26.54 0 top
R244  10K, 1%  [R0805]  26.67,28.57 0 top
R251  80, 0.1%  [0309/12]  38.1,15.62 180 top
R252  10K, 1%  [R0805]  26.67,15.11 0 top
R253  2K, 1%  [R0805]  26.67,17.14 0 top
R254  10K, 1%  [R0805]  26.67,19.18 0 top
R261  80, 0.1%  [0309/12]  38.1,8 180 top
R262  10K, 1%  [R0805]  26.67,7.49 0 top
R263  2K, 1%  [R0805]  26.67,9.53 0 top
R264  10K, 1%  [R0805]  26.67,11.56 0 top
R281  10K, 1%  [R0402]  100.33,88.65 90 top
R282  10K, 1%  [R0402]  101.6,88.65 90 top
R283  10K, 1%  [R0402]  102.87,88.65 90 top
R284  10K, 1%  [R0402]  104.14,88.65 90 top
R285  10K, 1%  [R0402]  104.14,100.84 270 top
R286  10K, 1%  [R0402]  102.87,100.84 270 top
R287  10K, 1%  [R0402]  101.6,100.84 270 top
R288  10K, 1%  [R0402]  100.33,100.84 270 top
R291  10K, 1%  [R0402]  100.33,76.45 90 top
R292  10K, 1%  [R0402]  101.6,76.45 90 top
R293  10K, 1%  [R0402]  102.87,76.45 90 top
R294  10K, 1%  [R0402]  104.14,76.45 90 top
RTC1  DS3231MZ+  [SO08]  66.93,71.12 270 top
S1  KMR231GLFS  [SW4SMD_63X161LS]  4.45,105.82 0 top
S2  KMR231GLFS  [SW4SMD_63X161LS]  11.94,105.82 0 top
S11  [P101]  114.81,92.71 180 top
S12  [P101]  114.81,103.5 180 top
S13  [DS-04]  114.81,81.03 90 top
T1  DA2304-AL  [DA230X-AL]  27.94,113.03 90 top
TP1  TPB0,65  [TP_B0,65]  57.15,81.28 0 bottom
TP2  TPB0,65  [TP_B0,65]  58.42,81.28 0 bottom
TP3  TPB0,65  [TP_B0,65]  62.23,81.28 0 bottom
TP4  TPB0,65  [TP_B0,65]  63.5,81.28 0 bottom
TP5  TESTPAD/W_HOLE_1X1  [TESTPAD/W_HOLE_1X1]  91.44,102.87 270 top
TP6  TESTPAD/W_HOLE_1X1  [TESTPAD/W_HOLE_1X1]  91.44,105.41 270 top
TP7  TESTPAD/W_HOLE_1X1  [TESTPAD/W_HOLE_1X1]  93.98,102.87 270 top
TP8  TESTPAD/W_HOLE_1X1  [TESTPAD/W_HOLE_1X1]  93.98,105.41 270 top
TP9  TESTPAD/W_HOLE_1X1  [TESTPAD/W_HOLE_1X1]  33.02,62.23 90 top
TP10  TESTPAD/W_HOLE_1X1  [TESTPAD/W_HOLE_1X1]  33.02,59.69 90 top
TP11  TPB0,65  [TP_B0,65]  68.58,92.71 0 bottom
TP12  TPB0,65  [TP_B0,65]  68.58,90.17 0 bottom
TP13  TPB0,65  [TP_B0,65]  63.5,96.52 0 bottom
TP14  TPB0,65  [TP_B0,65]  67.31,87.63 0 bottom
TP15  TPB0,65  [TP_B0,65]  59.69,85.09 0 bottom
TP16  TPB0,65  [TP_B0,65]  58.42,87.63 0 bottom
TP21  TPB0,65  [TP_B0,65]  60.96,96.52 0 bottom
TP22  TPB0,65  [TP_B0,65]  64.77,96.52 0 bottom
TP23  TPB0,65  [TP_B0,65]  68.58,91.44 0 bottom
TP24  TPB0,65  [TP_B0,65]  68.58,88.9 0 bottom
TP26  TPB0,65  [TP_B0,65]  62.23,96.52 0 bottom
TP27  TPB0,65  [TP_B0,65]  41.27,66.04 0 top
TP28  TPB0,65  [TP_B0,65]  40.01,66.04 0 top
TP29  TPB0,65  [TP_B0,65]  41.27,67.31 0 top
TP30  TPB0,65  [TP_B0,65]  40.01,67.31 0 top
TP31  TPB0,65  [TP_B0,65]  19.3,103.12 0 bottom
TP32  TPB0,65  [TP_B0,65]  49.53,87.63 0 bottom
TP33  TPB0,65  [TP_B0,65]  69.85,93.98 0 bottom
U1  OSD3358-512M-ICB  [OSD335X-BGA-400]  60.96,88.9 270 top
U2  TPD4S012_DRY_6_P1_M  [DRY6]  9.91,100.2 180 top
U4  APX811-31UGSOT  [SOT143-R]  14.96,102.34 180 top
U5  TLVH431  [SOT23-3]  64.77,87.63 270 bottom
U6  SN74LVC2G241_DCU_8  [DCU8]  35.56,66.04 0 top
U16  AT97SC3205T-G3M4400B  [QFN32-0.4-4X4MM]  41.91,60.58 0 top
U21  S25FL127S  [W-PDFN-8]  49.53,69.85 0 top
U25  ISO3086TDW  [DW16]  45.72,113.03 90 top
U27  LAN8710  [LAN8710A-QFN32]  35.56,79.38 0 top
U28  TCAN1051HV  [BEAGLEBONE_BLUE_D8]  26.04,64.26 180 top
U$1  [OSHW_8MM]  72.39,16.51 0 top
U$2  [XYZ-LABEL]  60.96,0.64 0 top
VREG1  LM2596SX-ADJ  [TO263-5]  73.15,116.84 0 top
VREG2  L7824CV  [78XXL]  85.72,112.65 0 top
VREG3  TPS76350  [DBV5]  36.7,117.47 0 top
X1  10118192-0001LF  [10118192-0001LF(MICRO-USB-B-AMPHENOL-FCI)]  1.45,100.33 90 bottom
X2  J0011D01BNL  [SI-50170]  7.87,82.55 90 top
X3  MC4  [MC4]  8.13,63.75 270 top
X4  CTI-JTAG  [CTI-JTAG]  78.74,67.31 0 top
X5  DM3CS-SF  [DM3CS-SF]  24.13,95 270 top
X6  6p-2.54  [H6-2.54]  19.68,69.6 270 top
X7  TH-2X10  [H2X10-2.54]  92.71,88.9 0 top
X10  MC4  [MC4]  8.13,46.74 270 top
X11  MC4  [MC4]  8.13,29.72 270 top
X12  MC4  [MC4]  8.13,12.7 270 top
X21  MC10  [MC10]  113.79,42.93 90 top
X22  MC2  [MC2]  113.79,18.29 90 top
X23  MC2  [MC2]  113.79,8.89 90 top
X24  MSTBA2  [MSTBA2]  116.84,115.57 90 top
X41  MSTBA3  [MSTBA3]  5.08,116.84 270 top
Y7  7A-25.000MAAE-T  [CRYSTAL-TXC-7A]  35.56,71.37 180 top

## Tracks (layer width: path | path; a pad name or v marks a point on that pad's centre or on a via)
1P8V_REF  (via drill 0.3)
  Top 0.152: 57.2,8.99 57.2,8.33 | 57.2,8.33 57.2,7.59 | IC14.4 57.24,8.29 57.2,8.33
  Top 0.254: IC14.4 59.26,8.29 59.84,7.71 59.84,7.08 60.53,6.39 IC14.1
  Top 0.305: v28.98,49.15 R212.2 | v28.98,41.53 R222.2 | v28.98,32.13 R232.2 | v28.98,24.51 R242.2 | v28.98,15.11 R252.2 | v28.98,7.49 R262.2 | v51.44,28.17 IC11.8 | v51.44,24.94 IC11.8 | v51.44,45.19 IC10.8 | v51.44,41.96 IC10.8 | v51.44,11.15 IC12.8 | v51.44,7.92 IC12.8 | IC12.8 53.5,9.55 55.45,7.59 57.2,7.59 | IC11.8 53.65,26.56 54.86,25.34 54.86,9.53 56.11,8.28 57.2,8.28 | IC10.8 54.61,43.58 55.88,42.31 55.88,9.83 56.72,8.99 57.2,8.99
  Bottom 0.305: v51.44,41.96 49.81,40.34 30.18,40.34 v28.98,41.53 | v28.98,49.15 30.5,47.62 50.16,47.62 51.44,46.35 v51.44,45.19 | v28.98,32.13 30.5,30.61 50.16,30.61 51.44,29.34 v51.44,28.17 | v28.98,24.51 30.18,23.32 49.81,23.32 v51.44,24.94 | v28.98,15.11 30.5,13.59 50.16,13.59 51.44,12.32 v51.44,11.15 | v28.98,7.49 29.74,6.73 50.32,6.73 51.44,7.85 v51.44,7.92
  pour Top: 57.15,8.97 57.15,7.62 57.4,7.37 59.64,7.37 59.89,7.62 59.89,8.97 59.64,9.22 57.4,9.22
5V_OUT
  pour Top (rank 2): 60.33,106.78 60.33,123.83 60.96,124.46 66.55,124.46 67.18,123.83 67.18,113.92 67.44,113.67 71.7,113.67 71.96,113.41 71.96,106.78 70.69,105.51 61.59,105.51
24VAC
  pour Top: 101.09,102.95 104.9,102.95 105.16,102.69 105.16,102.26 105.41,102.01 107.95,102.01 108.2,102.26 108.2,106.35 107.95,106.6 101.09,106.6 100.84,106.35 100.84,103.2
24VAC_IN
  Top 1.27: X24.1 109.45,113.03 106.68,110.26 F1.P$1
24VAC_UNREG  (via drill 0.3)
  Top 0.508: VREG2.IN C105.1
  other vias: 68.58,110.49 68.58,111.51 68.58,109.47 69.52,109.47 97.54,112.27 97.54,111.25 98.55,111.25 98.55,112.27 99.57,111.25 97.54,113.28
  pour Top: 65.81,111.89 65.81,109.45 66.07,109.19 70.03,109.19 70.28,109.45 70.28,111.89 70.03,112.14 66.07,112.14
  pour Top: 99.82,110.31 99.82,103.2 99.57,102.95 97.03,102.95 96.77,103.2 96.77,115.82 97.03,116.08 101.85,116.08 102.11,115.82 102.11,110.82 101.85,110.57 100.08,110.57
  pour Bottom: 84.76,110.57 101.85,110.57 102.11,110.82 102.11,115.82 101.85,116.08 92.46,116.08 92.2,115.82 92.2,113.92 91.95,113.67 66.07,113.67 65.81,113.41 65.81,109.45 66.07,109.19 80.26,109.19 80.52,108.94 80.52,106.96 80.77,106.71 84.25,106.71 84.51,106.96 84.51,110.31
24VDC_AUX  (via drill 0.3)
  Top 0.203: VREG2.OUT 94.61,108.84 95.89,110.11 95.89,124.33 97.16,125.6 D19.1
  Top 0.254: K1.1 101.98,55.53
  Top 0.305: K2.1 80.52,54.1 100.55,54.1 101.98,55.53 | 109.84,44.83 D32.1 D31.1 109.84,59.42 109.19,60.07 103.22,60.07 101.95,58.8 K1.1 | 109.84,44.83 D33.1 D34.1 109.84,29.59 | 109.84,29.59 D35.1 | K4.1 80.52,37.59 100.52,37.59 K3.1 107.76,44.83 109.84,44.83 | K5.1 105.11,22.51 106.38,23.78 106.38,28.32 107.64,29.59 109.84,29.59
  Top 0.508: VREG2.OUT C106.1
  Bottom 0.813: VREG2.OUT 94.59,108.84 95.89,107.54 v95.89,63.37 95.89,58.85 99.21,55.53 K1.1 | X3.4 11.66,58.04 12.27,57.43 93.47,57.43 94.87,58.83 v94.87,63.37
  other vias: 96.9,63.37
  pour Top: 97.54,64.21 97.54,63.25 97.28,62.99 94.36,62.99 94.11,63.25 94.11,64.21 94.36,64.47 97.28,64.47
  pour Bottom: 97.54,64.21 97.54,63.25 97.28,62.99 94.36,62.99 94.11,63.25 94.11,64.21 94.36,64.47 97.28,64.47
AGND  (via drill 0.3)
  Top 0.152: v59.66,73.15 59.31,72.8 R25.2
  Top 0.254: C9.2 C8.2 v64.06,61.44 | v62.94,66.06 C10.2 | v62.31,7.34 IC14.2
  Top 0.305: R213.2 32.64,51.18 33.91,52.45 C111.2 43.18,53.21 44.45,51.94 R211.1 | R223.2 32.64,43.56 33.91,44.83 C121.2 43.13,45.59 44.4,44.32 44.4,42.09 R221.1 | R233.2 32.64,34.16 33.91,35.43 C131.2 43.18,36.2 44.45,34.92 R231.1 | R243.2 32.64,26.54 33.91,27.81 C141.2 43.18,28.57 44.45,27.3 R241.1 | R253.2 32.64,17.14 33.91,18.41 C151.2 43.18,19.18 44.45,17.91 R251.1 | R263.2 32.64,9.53 33.91,10.79 C161.2 43.18,11.56 44.45,10.29 R261.1 | v47.62,17.48 47.62,15.86 IC12.4 | v47.62,34.49 47.62,32.88 IC11.4 | v47.62,51.51 IC10.4
  Top 0.508: v59.66,74.68 59.05,75.29 U1.Y9
  other vias: 59.11,73.91
  pour Top: 59.87,75.18 59.87,72.64 58.9,72.64 58.9,75.18
  pour Route2: 58.12,61.77 58.12,78.74 58.75,79.38 62.87,79.38 63.5,78.74 63.5,68.3 64.77,67.03 64.77,60.88 62.89,59 62.89,1.27 62.26,0.64 40.01,0.64 39.37,1.27 39.37,5.08 38.1,6.35 34.29,6.35 33.02,5.08 33.02,1.27 32.38,0.64 6.35,0.64 5.71,1.27 5.71,55.98 6.35,56.62 52.96,56.62
AIN1  (via drill 0.3)
  Top 0.152: U1.W10 59.84,77.62 59.84,76.1 60.5,75.44 60.5,61.19 58.17,58.85 58.17,51.74 v57.94,51.51
  Top 0.305: IC10.2 IC10.1 v51.44,51.51
  Bottom 0.152: v51.44,51.51 v57.94,51.51
AIN2  (via drill 0.3)
  Top 0.152: U1.V10 59.54,78.59 59.54,75.97 60.2,75.31 60.2,61.32 57.4,58.52 57.4,45.41 v57.17,45.19
  Top 0.305: IC10.6 IC10.7 v50.16,45.19
  Bottom 0.152: v50.16,45.19 51.77,43.59 55.58,43.59 v57.17,45.19
AIN3  (via drill 0.3)
  Top 0.152: U1.V9 58.27,78.59 58.27,68.05 59.89,66.42 59.89,61.44 56.64,58.19 56.64,34.67 v56.49,34.52
  Top 0.305: IC11.2 51.41,32.87 | 51.41,32.87 IC11.1 | v51.44,34.49 51.44,32.9 51.41,32.87
  Bottom 0.152: v56.49,34.52 51.46,34.52 v51.44,34.49
AIN4  (via drill 0.3)
  Top 0.152: U1.Y11 61.59,60.98 60.45,59.84 60.45,28.4 v60.22,28.17
  Top 0.305: IC11.6 IC11.7 v50.16,28.17
  Bottom 0.152: v50.16,28.17 51.77,26.57 58.62,26.57 v60.22,28.17
AIN5  (via drill 0.3)
  Top 0.152: U1.W11 61.11,77.62 61.11,60.94 59.69,59.51 59.69,17.7 v59.46,17.48
  Top 0.305: IC12.2 IC12.1 v51.44,17.48
  Bottom 0.152: v51.44,17.48 v59.46,17.48
AIN6  (via drill 0.3)
  Top 0.152: U1.V11 60.81,78.59 60.81,61.06 58.93,59.18 58.93,11.38 v58.7,11.15
  Top 0.305: IC12.6 IC12.7 v50.16,11.15
  Bottom 0.152: v50.16,11.15 51.77,9.55 57.1,9.55 v58.7,11.15
AIN7
  Top 0.152: U1.U12 U1.V12
B03_NO
  Bottom 1.27: X21.6 111.25,44.83 102.13,35.71 93.06,35.71 K3.NO
B_UART0_RX
  Top 0.152: X6.4 19.94,68.07 R27.2 32.77,66.8 33.28,66.29 U6.2
B_UART0_TX
  Top 0.152: U6.3 33.12,65.79 31.34,67.56 17.91,67.56 X6.5
BAT_SENSE
  Top 0.152: U1.E19 72.54,96.67 77.06,96.67 79.12,98.73 86.39,98.73 86.94,99.29 86.94,102.56 87.58,103.2 89.23,103.2 TP6.P$1
BO1_C
  Bottom 1.27: X21.9 111.25,56.26 104.52,49.53 K1.C
BO1_NO
  Bottom 1.27: X21.10 111.25,60.07 103.63,52.45 92.83,52.45 K1.NO
BO2_C
  Bottom 1.27: X21.7 111.25,48.64 103.89,41.27 89.34,41.27 K2.C
BO2_NO
  Bottom 0.152: 111.35,52.45 111.25,52.45
  Bottom 1.27: X21.8 111.35,52.45 105.51,46.61 91.62,46.61 85.72,52.5 69.92,52.5 K2.NO
BO3_C
  Bottom 1.27: X21.5 111.43,41.02 103.95,33.54 K3.C
BO4_C
  Bottom 1.27: X21.3 111.91,33.4 103.28,24.77 89.34,24.77 K4.C
BO4_NO
  Bottom 1.27: X21.4 111.61,37.21 104.42,30.02 91.62,30.02 85.7,35.94 69.97,35.94 K4.NO
BO5_C
  Bottom 1.27: X21.1 112.79,25.78 103.95,16.94 K5.C
BO5_NO
  Bottom 1.27: X21.2 112.32,29.59 102.51,19.79 92.28,19.79 89.75,22.32 K5.NO
CAN1_RXD
  Top 0.152: U1.Y7 56.52,64.39 55.88,63.75 31.67,63.75 31.04,64.39 31.04,65.53 30.4,66.17 U28.4 27.38,66.17 26.75,65.53 26.75,63.63 27.38,62.99 29.59,62.99 30.23,62.36 30.23,58.32 29.59,57.68 24,57.68 23.37,58.32 D8.1
CAN1_TXD
  Top 0.152: U1.W7 56.52,78.08 56.03,77.6 56.03,64.9 55.4,64.26 32.28,64.26 31.65,64.9 31.65,66.42 31.01,67.06 26.67,67.06 26.04,66.42 26.04,62.99 26.67,62.36 U28.1 28.5,59.58 27.86,58.94 D2.1
CAN_H
  Top 0.508: X3.1 6.58,69.47 5.31,68.2 5.31,64.9 6.58,63.62 D20.C U28.7
CAN_L
  Top 0.508: X3.2 19.02,65.66 D21.C 20.91,65.63 21.64,64.9 U28.6
CGND  (via drill 0.3)
  Top 0.305: v36.83,94.44 36.83,93.45 X5.11 | v36.83,99.47 X5.13
  Top 0.508: R181.2 12.7,48.01 11.43,46.74 5.71,46.74 | R182.2 12.7,40.39 11.43,39.12 5.71,39.12 | R183.2 12.7,30.99 11.43,29.72 5.71,29.72 | R184.2 12.62,23.37 11.35,22.1 5.71,22.1 | R185.2 12.7,13.97 11.43,12.7 5.71,12.7 | R186.2 12.7,6.35 11.43,5.08 5.71,5.08
  Top 0.813: D21.A 17.29,61.56 15.28,59.55 D20.A 12.14,59.55 9.85,61.85 X3.3 5.61,61.85 5.59,61.87
  Bottom 0.305: v36.83,99.47 v36.83,94.44
  Bottom 0.813: X2.S2 22.25,90.42 v22.81,90.98
  other vias: 22.81,91.9
  pour Top: 5.71,57.15 -5.08,57.15 -5.08,-5.08 127,-5.08 127,57.15 120.65,57.15 120.65,5.08 120.02,4.45 113.67,4.45 113.03,3.81 113.03,1.27 112.39,0.64 89.56,0.64 88.93,1.27 88.93,5.08 87.66,6.35 83.82,6.35 82.55,5.08 82.55,1.27 81.92,0.64 40.01,0.64 39.37,1.27 39.37,5.08 38.1,6.35 34.29,6.35 33.02,5.08 33.02,1.27 32.38,0.64 15.24,0.64 14.61,1.27 14.61,3.81 13.97,4.45 6.35,4.45 5.71,5.08
  pour Bottom (rank 6): -1.27,57.15 5.71,57.15 5.71,72.14 6.35,72.77 11.56,72.77 12.83,74.04 12.83,75.31 11.56,76.58 10.64,76.58 8.86,74.8 6.91,74.8 5.71,76 5.71,97.46 5.08,98.09 3.05,98.09 3.05,102.54 5.08,102.54 6.35,103.81 6.35,125.73 6.99,126.36 32.38,126.36 33.02,125.73 33.02,121.92 34.29,120.65 38.1,120.65 39.37,121.92 39.37,125.73 40.01,126.36 79.76,126.36 80.39,125.73 80.39,120.4 81.66,119.13 89.79,119.13 91.06,120.4 91.06,125.73 91.69,126.36 112.39,126.36 113.03,125.73 113.03,120.02 115.57,117.47 120.02,117.47 120.65,116.84 120.65,57.15 123.19,57.15 123.19,128.27 -1.27,128.27
  pour Bottom (rank 6): 5.71,57.15 -1.27,57.15 -1.27,-1.27 123.19,-1.27 123.19,57.15 120.65,57.15 120.65,5.08 120.02,4.45 113.67,4.45 113.03,3.81 113.03,1.27 112.39,0.64 89.56,0.64 88.93,1.27 88.93,5.08 87.66,6.35 83.82,6.35 82.55,5.08 82.55,1.27 81.92,0.64 40.01,0.64 39.37,1.27 39.37,5.08 38.1,6.35 34.29,6.35 33.02,5.08 33.02,1.27 32.38,0.64 6.35,0.64 5.71,1.27
  pour Top: -5.08,57.15 5.71,57.15 5.71,62.87 5.08,63.5 1.91,63.5 1.27,64.14 1.27,89.66 1.91,90.3 8.86,90.3 10.64,88.52 11.56,88.52 12.83,89.79 12.83,91.06 11.56,92.33 1.91,92.33 1.27,92.96 1.27,125.73 1.91,126.36 32.38,126.36 33.02,125.73 33.02,121.92 34.29,120.65 38.1,120.65 39.37,121.92 39.37,125.73 40.01,126.36 81.92,126.36 82.55,125.73 82.55,121.92 83.82,120.65 87.63,120.65 88.9,121.92 88.9,125.73 89.53,126.36 112.39,126.36 113.03,125.73 113.03,120.02 115.57,117.47 120.02,117.47 120.65,116.84 120.65,57.15 127,57.15 127,132.08 -5.08,132.08
  pour Top: 22.86,94.26 22.86,103.38 23.11,103.63 26.16,103.63 26.42,103.89 26.42,105.51 26.16,105.77 21.08,105.77 20.83,105.51 20.83,90.42 21.08,90.17 26.16,90.17 26.42,90.42 26.42,91.95 26.67,92.2 37.85,92.2 38.1,92.46 38.1,93.75 37.85,94.01 23.11,94.01
  pour Bottom: 20.83,91.95 20.83,90.42 21.08,90.17 23.62,90.17 23.88,90.42 23.88,91.95 23.62,92.2 21.08,92.2
CLKOUT2
  Top 0.152: X4.18 79.2,62.87 78.56,63.5 74.24,63.5 73.61,64.14 72.9,64.14 | 72.9,64.14 C2.2 | R3.2 72.9,64.14
CRS
  Top 0.152: ER124.1 43.1,80.72 39.85,80.72 39.26,80.13 U27.14
E_LED_GRN  (via drill 0.3)
  Top 0.152: X2.C2 2.31,88.88 1.68,88.24 1.68,72.36 2.95,71.09 30.38,71.09 31.27,71.98 31.27,73.53 v32.23,74.5 | U27.3 34.81,76.01 v34.77,75.97
  Bottom 0.152: v32.23,74.5 32.38,74.65 33.96,74.65 34.77,75.46 v34.77,75.97
E_LED_YEL  (via drill 0.3)
  Top 0.152: X2.A1 4.56,73.81 5.19,73.18 28.17,73.18 ER120.2 29.18,74.19 31.04,74.19 v31.34,74.5 | U27.2 34.31,76.3 34.09,76.07 v34.09,75.62
  Bottom 0.152: v31.34,74.5 31.9,75.06 33.53,75.06 v34.09,75.62
EEPROM_WP
  Top 0.152: U1.M2 49.53,87.63 48.56,87.63 48.06,88.14 35.26,88.14 32.84,85.72 26.67,85.72 J1.1
EHRPWM1A  (via drill 0.3)
  Top 0.152: U1.C13 v64.77,99.06 | v84.58,71.75 84.58,69.14 86.72,67 86.72,61.06 85.8,60.15 70.1,60.15 68.83,58.88 68.83,23.14 v68.4,22.71
  Bottom 0.152: v64.77,99.06 64.77,98.27 65.68,97.36 70.99,97.36 71.81,96.55 71.81,89.43 73.51,87.73 74.57,87.73 75.39,86.92 75.39,74.22 76.91,72.69 84.28,72.69 84.58,72.39 v84.58,71.75
EHRPWM1B  (via drill 0.3)
  Top 0.152: U1.A12 v63.5,101.6
EHRPWM2A  (via drill 0.3)
  Top 0.152: U1.A17 v69.85,101.6 | v82.93,74.78 83.19,74.78 85.45,72.52 85.45,69.85 87.02,68.28 87.02,60.94 85.93,59.84 70.23,59.84 69.14,58.75 v69.14,22.1
  Bottom 0.152: v69.85,101.6 U1.A17 69.22,99.67 69.7,99.19 71.78,99.19 73.64,97.33 73.64,90.19 74.27,89.56 75.34,89.56 77.22,87.68 77.22,75.41 77.85,74.78 v82.93,74.78
EHRPWM2B  (via drill 0.3)
  Top 0.152: v68.58,99.11 67.94,98.48 U1.C16 | v84.3,74.5 84.76,74.5 86.06,73.2 86.06,70.81 87.33,69.55 87.33,60.81 86.06,59.54 70.36,59.54 69.44,58.62 69.44,23.14 v69.88,22.71
  Bottom 0.152: v68.58,99.11 68.81,98.88 71.63,98.88 73.33,97.18 73.33,90.07 74.14,89.26 75.21,89.26 76.91,87.55 76.91,74.85 77.55,74.22 84.02,74.22 v84.3,74.5
GND  (via drill 0.3, 0.3 pad 0.61)
  Top 0.152: U16.24 44.37,61.98 v44.58,61.77 44.38,61.58 U16.23 | U16.18 44.39,59.58 v44.58,59.77 44.36,59.98 U16.19 | U16.20 44.38,60.38 v44.58,60.58 44.38,60.78 U16.21 | U16.32 40.51,62.79 40.26,63.04 v39.98,63.04 | C22.2 40.21,102.11 38.79,103.53 35.13,103.53 34.49,102.89 34.49,101.55 32.99,100.05 26.19,100.05 v25.91,100.33 | VREG1.6 v73.15,118.87 | v38.48,58.8 38.63,58.65 40.48,58.65 U16.9 | U16.5 39.45,60.38 v39.24,60.17 39.44,59.98 U16.6 | v39.24,61.72 39.39,61.58 U16.2 | v34.54,79.38 U27.33
  Top 0.254: v40.51,75.92 ER103.2 | v40.51,74.85 ER102.2 | v40.51,73.79 ER104.2 | EC34.2 v43.31,79.12 | ER101.2 v40.51,80.19 | ER128.1 v27.81,74.68 | v24.26,75.69 EC36.2 | v24.26,77.47 EC37.2 | v24.26,78.49 EC38.2 | v24.26,80.26 EC39.2 | v30.61,73.66 ER120.1 ER115.1 ER117.1 | ER129.2 v40.51,84.45 | v24.26,81.28 EC40.2 | EC41.2 v31.93,69.09 | EC42.2 v39.19,69.09 | EC35.2 EC33.2 v38.89,73.74 | EC30.2 EC31.2 v32.23,73.74 | U1.Y1 v48.26,76.2 | U1.A1 v48.26,101.6 | U1.Y20 v73.66,76.2 | U1.A20 v73.66,101.6 | R27.1 C6.1 v34.21,67.28 34.09,67.16 U6.1 35,66.79 35.26,66.53 35.26,65.55 35,65.29 U6.4 | v29.95,63.63 U28.2 | R285.1 R286.1 R287.1 R288.1 v99.54,101.4 | IC4.15 v105.41,93.32 | IC4.8 v97.79,96.16 | v97.79,83.97 IC5.8 | IC5.6 IC5.5 IC5.4 IC5.3 v104.14,83.97 | v105.41,81.13 IC5.15 | R68.1 R67.1 R66.1 R65.1 R64.1 R63.1 R62.1 R61.1 R60.1 R59.1 R58.1 R57.1 R56.1 R55.1 R54.1 R53.1 R18.1 v81.92,97.16 | v79.5,71.75 X4.4 | v79.5,67.94 X4.10 | v79.5,64.14 X4.16 | v79.5,61.59 X4.20 | v69.98,64.14 C2.1 | v69.98,62.87 C1.1 | X4.8 X4.10 | X4.12 X4.10 | v8.91,106.6 9.88,106.6 S2.3 S2.1 | v85.98,63.37 C14.2 C15.2 | v85.98,66.42 R39.1 | S1.4 S1.2 v7.47,105.03 | U2.4 9.54,101.66 v9.78,101.91 | R38.2 v7.75,102.74 | R37.2 v7.75,100.71 | R36.2 v7.75,98.68 | R35.2 v7.75,96.65 | R26.2 v7.75,94.61 | v15.54,98.65 C3.2 | v21.08,107.82 R16.2 | v19.05,107.82 R17.2 | v39.62,105.74 39.9,105.46 C21.2 | v16.76,103.38 15.75,103.38 U4.1 | v17.78,99.03 R6.1 | VREG1.3 73.15,108.66 R165.1 | v77.72,110.49 77.01,110.49 76.56,110.95 VREG1.5 | v65.28,65.51 C104.2 | C93.2 v45.59,68.02 45.67,67.94 U21.4 | v50.32,73.1 R158.2 | v37.85,61.98 37.72,61.85 C87.2 | v45.97,59.18 C85.2 | R2.2 v25.02,58.55 | v21.84,58.55 R1.2
  Top 0.254: R281.1 R282.1 R283.1 R284.1 v104.93,88.09 | R294.1 R293.1 R292.1 R291.1 v99.54,75.89
  Top 0.305: C98.2 43.81,106.5 U25.3 v43.81,110.24
  Top 0.381: C79.2 C88.2 C87.2
  Top 0.508: X5.6 25.74,100.5 v25.91,100.33
  Top 0.813: VREG1.3 v73.15,115.82
  other vias: 9.02,101.9 90.68,63.37 38.61,108.33 38.61,109.09 9.78,102.67 9.02,102.67 28.32,87.76 29.08,87.76 68.58,96.52 67.31,96.52 68.58,95.25 68.58,93.98 67.31,86.36 68.58,86.36 67.31,81.03 68.58,81.03 53.34,81.28 53.34,82.55 54.61,82.55 55.88,82.55 54.61,83.82 55.88,83.82 57.15,83.82 58.42,83.82 54.61,85.09 53.59,85.09 53.59,86.36 53.59,87.63 53.59,88.9 54.61,88.9 53.59,90.17 53.59,91.44 58.42,89.03 53.34,96.52 54.61,96.39 55.88,96.39 57.15,96.39 60.96,95.25 88.65,63.37 89.66,63.37 57.91,109.73 57.91,108.71 57.91,107.7 51.44,125.09 51.44,124.08 68.58,107.67 68.58,106.68 34.54,78.36 35.56,78.36 76.2,115.82 74.17,115.82 75.18,115.82 72.14,115.82 70.1,115.82 71.12,115.82 76.2,116.84 74.17,116.84 75.18,116.84 72.14,116.84 73.15,116.84 70.1,116.84 71.12,116.84 76.2,117.86 74.17,117.86 75.18,117.86 72.14,117.86 73.15,117.86 70.1,117.86 71.12,117.86 76.2,118.87 74.17,118.87 75.18,118.87 72.14,118.87 70.1,118.87 71.12,118.87 76.2,119.89 74.17,119.89 75.18,119.89 72.14,119.89 73.15,119.89 70.1,119.89 71.12,119.89 76.2,120.9 74.17,120.9 75.18,120.9 72.14,120.9 73.15,120.9 70.1,120.9 71.12,120.9 76.2,121.92 74.17,121.92 75.18,121.92 72.14,121.92 73.15,121.92 70.1,121.92 71.12,121.92 34.54,80.39 35.56,80.39 36.58,80.39 36.58,79.38 36.58,78.36 82.55,101.98 82.55,99.95 82.55,100.97 60.96,94.11 63.5,83.82 64.77,83.82 66.04,83.82 67.28,83.82 67.26,82.55 66.04,82.55
  pour Route2 (rank 2): -3.81,130.81 125.73,130.81 125.73,-3.81 -3.81,-3.81
  pour Bottom (no thermals): 3.56,101.5 10.03,101.5 10.29,101.75 10.29,102.84 10.03,103.1 8.79,103.1 8.53,102.84 8.53,102.29 8.31,102.06 3.56,102.06
  pour Top: 29.69,86.16 29.69,87.88 29.44,88.14 27.97,88.14 27.71,87.88 27.71,86.16 27.97,85.9 29.44,85.9
  pour Top: 52.7,80.64 52.7,82.55 53.34,82.55 53.34,95.25 52.7,95.25 52.7,97.16 54.61,97.16 54.61,96.52 60.33,96.52 60.33,95.89 54.61,95.89 54.61,89.53 59.05,89.53 59.05,90.81 64.14,90.81 64.14,90.17 63.5,90.17 63.5,89.53 62.23,89.53 62.23,90.17 59.69,90.17 59.69,88.9 55.88,88.9 55.88,88.27 54.61,88.27 54.61,85.72 55.24,85.72 55.24,84.45 59.05,84.45 59.05,83.19 62.87,83.19 62.87,84.45 66.67,84.45 66.67,89.53 67.94,89.53 67.94,95.89 61.59,95.89 61.59,96.52 66.04,96.52 66.04,97.16 69.22,97.16 69.22,93.98 68.58,93.98 68.58,82.55 69.22,82.55 69.22,80.64 66.67,80.64 66.67,81.92 54.61,81.92 54.61,80.64
  pour Top: 60.33,93.93 61.59,93.93 61.59,96.52 60.33,96.52
  pour Top: 36.91,109.73 36.91,107.7 39.24,107.7 39.24,109.73
  pour Top: 88.14,62.99 91.19,62.99 91.44,63.25 91.44,64.21 91.19,64.47 88.14,64.47 87.88,64.21 87.88,63.25
  pour Top: 58.17,106.32 55.85,106.32 54.58,107.59 54.58,110.87 54.84,111.12 58.17,111.12 58.42,110.87 58.42,106.58
  pour Top: 51.82,125.4 49.12,125.4 48.87,125.15 48.87,123.44 49.12,123.19 51.82,123.19 52.07,123.44 52.07,125.15
  pour Top: 65.84,107.72 65.84,105.77 66.09,105.51 68.99,105.51 69.24,105.77 69.24,107.72 68.99,107.98 66.09,107.98
  pour Top: 87.05,110.31 87.05,104.27 86.79,104.01 80.75,104.01 80.49,104.27 80.49,106.45 80.75,106.71 84.25,106.71 84.51,106.96 84.51,110.31 84.76,110.57 86.79,110.57
  pour Top: 112.39,119.76 112.39,124.46 112.14,124.71 109.14,124.71 108.89,124.46 108.89,117.02 109.78,116.13 114.15,116.13 115.09,117.07
  pour Top: 86.11,99.24 82.55,99.24 82.3,99.49 82.3,102.44 82.55,102.69 86.11,102.69 86.36,102.44 86.36,99.49
  pour Bottom: 63.2,94.61 63.2,92.08 60.33,92.08 60.33,95.5 61.59,95.5 61.59,94.61
GPIO1_12  (via drill 0.3)
  Top 0.152: U1.C15 v67.31,99.06 | v88.14,71.75 IC2.2
  Bottom 0.152: v67.31,99.06 67.79,98.58 71.5,98.58 73.03,97.05 73.03,89.94 74.02,88.95 75.08,88.95 76.61,87.43 76.61,74.73 77.42,73.91 84.91,73.91 86.06,72.77 86.06,72.39 86.69,71.75 v88.14,71.75
GPIO1_13  (via drill 0.3)
  Top 0.152: U1.B15 v67.33,100.36 | v88.14,70.48 IC2.3
  Bottom 0.152: v67.33,100.36 66.78,99.8 66.78,98.78 67.28,98.27 71.37,98.27 72.72,96.93 72.72,89.81 73.89,88.65 74.95,88.65 76.3,87.3 76.3,74.6 77.29,73.61 84.78,73.61 85.75,72.64 85.75,71.12 86.39,70.48 v88.14,70.48
GPIO1_14  (via drill 0.3)
  Top 0.152: U1.A15 v67.31,101.6 | v88.14,69.22 IC2.4